# Altium project C27337A_NI_STS_IFX_C55SOI_302149633_V3_04.PrjPcb (part 2 of 2)

## Sheet 43-PSU_SMU_HP.SchDoc
size 594 x 420 mm
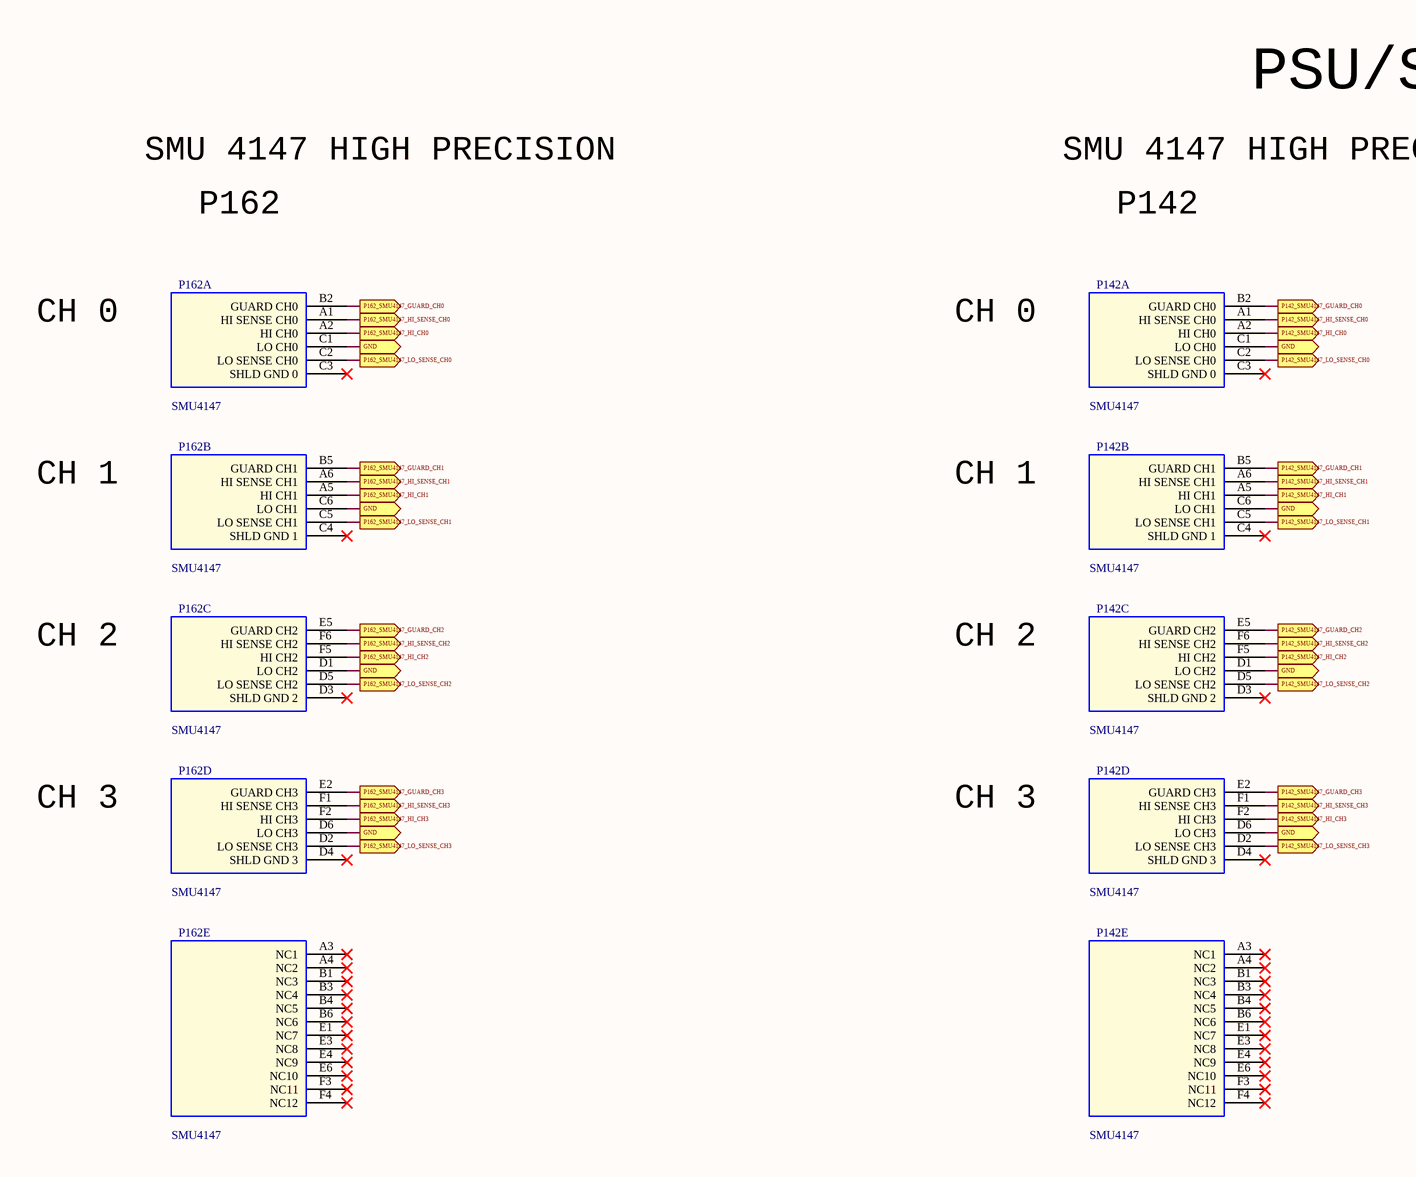
[diagram p23: 43-PSU_SMU_HP.SchDoc, top left]
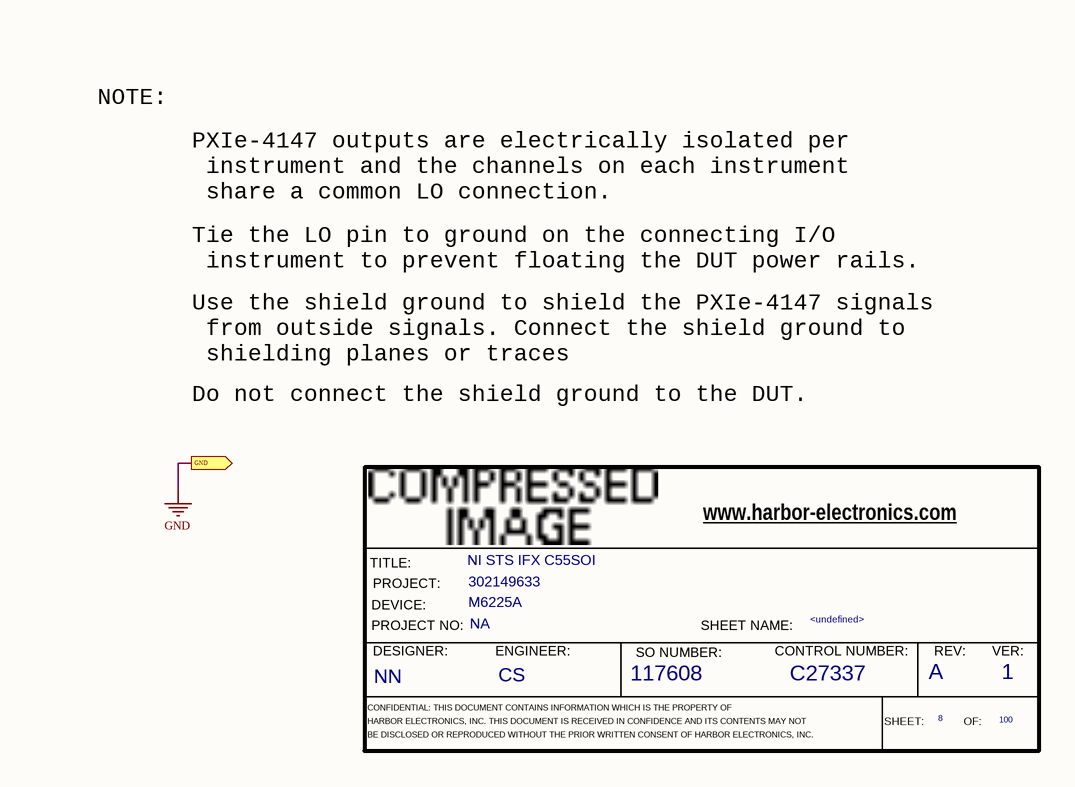
[diagram p24: 43-PSU_SMU_HP.SchDoc, bottom right]

### Parts
(Parts that share a designator on the sheet are numbered #1, #2 ... from top to bottom, then left to right.)
*#9  RevCode: A  Title: NI STS IFX C55SOI  Page Number: 8  Page Count: 100  Engineer: CS  Designer: NN  SO Number: 117608  Control Number: C27337  Version: 1  Page Name: <undefined>  PROJECT: 302149633  DEVICE: M6225A  PROJECT NO.: NA  (hidden comment: HE_DEFAULT)  (graphical)
P142  SMU4147  [285092A-08_36PIN]  (parts A,B,C,D,E of 5)
P162  SMU4147  [285092A-08_36PIN]  (parts A,B,C,D,E of 5)

### Ports
GND (out), P142_SMU4147_GUARD_CH0 (out), P142_SMU4147_GUARD_CH1 (out), P142_SMU4147_GUARD_CH2 (out), P142_SMU4147_GUARD_CH3 (out), P142_SMU4147_HI_CH0 (out), P142_SMU4147_HI_CH1 (out), P142_SMU4147_HI_CH2 (out), P142_SMU4147_HI_CH3 (out), P142_SMU4147_HI_SENSE_CH0 (out), P142_SMU4147_HI_SENSE_CH1 (out), P142_SMU4147_HI_SENSE_CH2 (out), P142_SMU4147_HI_SENSE_CH3 (out), P142_SMU4147_LO_SENSE_CH0 (out), P142_SMU4147_LO_SENSE_CH1 (out), P142_SMU4147_LO_SENSE_CH2 (out), P142_SMU4147_LO_SENSE_CH3 (out), P162_SMU4147_GUARD_CH0 (out), P162_SMU4147_GUARD_CH1 (out), P162_SMU4147_GUARD_CH2 (out), P162_SMU4147_GUARD_CH3 (out), P162_SMU4147_HI_CH0 (out), P162_SMU4147_HI_CH1 (out), P162_SMU4147_HI_CH2 (out), P162_SMU4147_HI_CH3 (out), P162_SMU4147_HI_SENSE_CH0 (out), P162_SMU4147_HI_SENSE_CH1 (out), P162_SMU4147_HI_SENSE_CH2 (out), P162_SMU4147_HI_SENSE_CH3 (out), P162_SMU4147_LO_SENSE_CH0 (out), P162_SMU4147_LO_SENSE_CH1 (out), P162_SMU4147_LO_SENSE_CH2 (out), P162_SMU4147_LO_SENSE_CH3 (out)

### Nets
GND: P142.C1(LO_CH0) P142.C6(LO_CH1) P142.D1(LO_CH2) P142.D6(LO_CH3) P162.C1(LO_CH0) P162.C6(LO_CH1) P162.D1(LO_CH2) P162.D6(LO_CH3) ; port GND
NetP142_A1: P142.A1(HI_SENSE_CH0) ; port P142_SMU4147_HI_SENSE_CH0
NetP142_A2: P142.A2(HI_CH0) ; port P142_SMU4147_HI_CH0
NetP142_A5: P142.A5(HI_CH1) ; port P142_SMU4147_HI_CH1
NetP142_A6: P142.A6(HI_SENSE_CH1) ; port P142_SMU4147_HI_SENSE_CH1
NetP142_B2: P142.B2(GUARD_CH0) ; port P142_SMU4147_GUARD_CH0
NetP142_B5: P142.B5(GUARD_CH1) ; port P142_SMU4147_GUARD_CH1
NetP142_C2: P142.C2(LO_SENSE_CH0) ; port P142_SMU4147_LO_SENSE_CH0
NetP142_C5: P142.C5(LO_SENSE_CH1) ; port P142_SMU4147_LO_SENSE_CH1
NetP142_D2: P142.D2(LO_SENSE_CH3) ; port P142_SMU4147_LO_SENSE_CH3
NetP142_D5: P142.D5(LO_SENSE_CH2) ; port P142_SMU4147_LO_SENSE_CH2
NetP142_E2: P142.E2(GUARD_CH3) ; port P142_SMU4147_GUARD_CH3
NetP142_E5: P142.E5(GUARD_CH2) ; port P142_SMU4147_GUARD_CH2
NetP142_F1: P142.F1(HI_SENSE_CH3) ; port P142_SMU4147_HI_SENSE_CH3
NetP142_F2: P142.F2(HI_CH3) ; port P142_SMU4147_HI_CH3
NetP142_F5: P142.F5(HI_CH2) ; port P142_SMU4147_HI_CH2
NetP142_F6: P142.F6(HI_SENSE_CH2) ; port P142_SMU4147_HI_SENSE_CH2
NetP162_A1: P162.A1(HI_SENSE_CH0) ; port P162_SMU4147_HI_SENSE_CH0
NetP162_A2: P162.A2(HI_CH0) ; port P162_SMU4147_HI_CH0
NetP162_A5: P162.A5(HI_CH1) ; port P162_SMU4147_HI_CH1
NetP162_A6: P162.A6(HI_SENSE_CH1) ; port P162_SMU4147_HI_SENSE_CH1
NetP162_B2: P162.B2(GUARD_CH0) ; port P162_SMU4147_GUARD_CH0
NetP162_B5: P162.B5(GUARD_CH1) ; port P162_SMU4147_GUARD_CH1
NetP162_C2: P162.C2(LO_SENSE_CH0) ; port P162_SMU4147_LO_SENSE_CH0
NetP162_C5: P162.C5(LO_SENSE_CH1) ; port P162_SMU4147_LO_SENSE_CH1
NetP162_D2: P162.D2(LO_SENSE_CH3) ; port P162_SMU4147_LO_SENSE_CH3
NetP162_D5: P162.D5(LO_SENSE_CH2) ; port P162_SMU4147_LO_SENSE_CH2
NetP162_E2: P162.E2(GUARD_CH3) ; port P162_SMU4147_GUARD_CH3
NetP162_E5: P162.E5(GUARD_CH2) ; port P162_SMU4147_GUARD_CH2
NetP162_F1: P162.F1(HI_SENSE_CH3) ; port P162_SMU4147_HI_SENSE_CH3
NetP162_F2: P162.F2(HI_CH3) ; port P162_SMU4147_HI_CH3
NetP162_F5: P162.F5(HI_CH2) ; port P162_SMU4147_HI_CH2
NetP162_F6: P162.F6(HI_SENSE_CH2) ; port P162_SMU4147_HI_SENSE_CH2

Not connected (* = marked no-connect by the designer): P142 A3(NC1)* A4(NC2)* B1(NC3)* B3(NC4)* B4(NC5)* B6(NC6)* C3(SHLD_GND_0)* C4(SHLD_GND_1)* D3(SHLD_GND_2)* D4(SHLD_GND_3)* E1(NC7)* E3(NC8)* E4(NC9)* E6(NC10)* F3(NC11)* F4(NC12)*; P162 A3(NC1)* A4(NC2)* B1(NC3)* B3(NC4)* B4(NC5)* B6(NC6)* C3(SHLD_GND_0)* C4(SHLD_GND_1)* D3(SHLD_GND_2)* D4(SHLD_GND_3)* E1(NC7)* E3(NC8)* E4(NC9)* E6(NC10)* F3(NC11)* F4(NC12)*

### Notes on the sheet
- PSU/SMU
- SMU 4147 HIGH PRECISION
- P162
- P142
- CH 0
- CH 1
- CH 2
- CH 3
- NOTE:
- PXIe-4147 outputs are electrically isolated per
  instrument and the channels on each instrument
  share a common LO connection.
- Tie the LO pin to ground on the connecting I/O
  instrument to prevent floating the DUT power rails.
- Use the shield ground to shield the PXIe-4147 signals
  from outside signals. Connect the shield ground to
  shielding planes or traces
- Do not connect the shield ground to the DUT.
- (in symbol HE_DEFAULT) www.harbor-electronics.com; TITLE:; PROJECT:; DEVICE:; PROJECT NO:; SHEET NAME:; DESIGNER:; ENGINEER:; SO NUMBER:; CONTROL NUMBER:; REV:; VER:; CONFIDENTIAL: THIS DOCUMENT CONTAINS INFORMATION WHICH IS THE PROPERTY OF; HARBOR ELECTRONICS, INC. THIS DOCUMENT IS RECEIVED IN CONFIDENCE AND ITS CONTENTS MAY NOT; SHEET:; OF:; BE DISCLOSED OR REPRODUCED WITHOUT THE PRIOR WRITTEN CONSENT OF HARBOR ELECTRONICS, INC.

### Library data of the parts
*#9 = HE_DEFAULT: Page Size: X; OrgAddr4: Fax: +1 602-431-9633; OrgAddr1: 4050 E. Cotton Center Blvd., Suite 33; OrgAddr2: Phoenix, Arizona 85040 U.S.A.; OrgAddr3: Phone: +1 602-438-1112; Doc: <Title Name>; OrgName: HARBOR
P142 P162 = SMU4147: SPLIT_INST: TRUE; SWAP_INFO: (S1+S2+S3+S4+S5); PCB Footprint: 285092A-08_36PIN

## Sheet 45-RELAY_MUX_SWITCH.SchDoc
size 594 x 420 mm
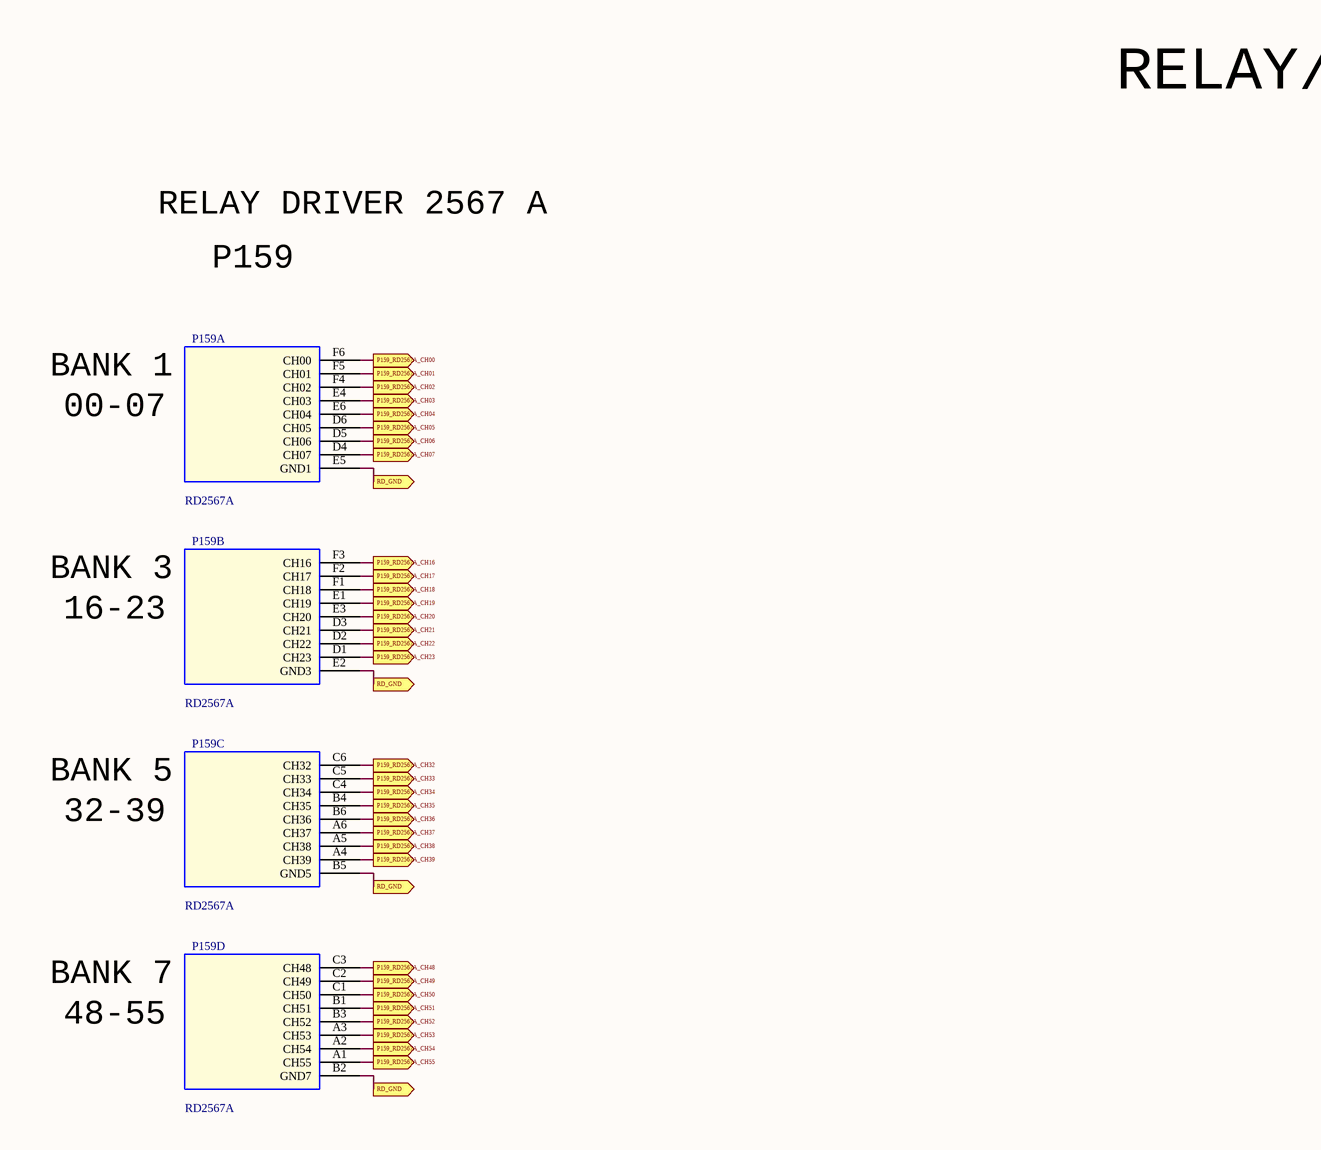
[diagram p25: 45-RELAY_MUX_SWITCH.SchDoc, top left]
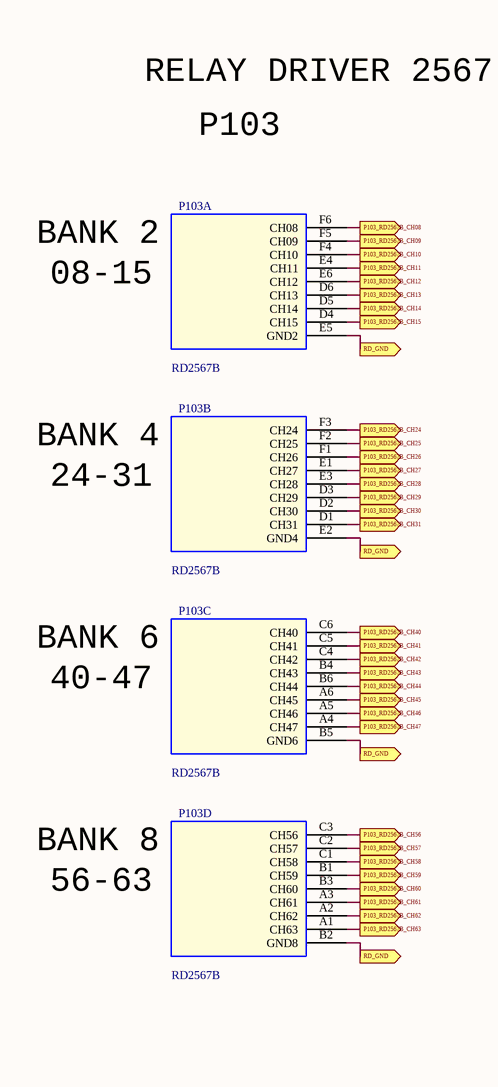
[diagram p26: 45-RELAY_MUX_SWITCH.SchDoc, bottom left]
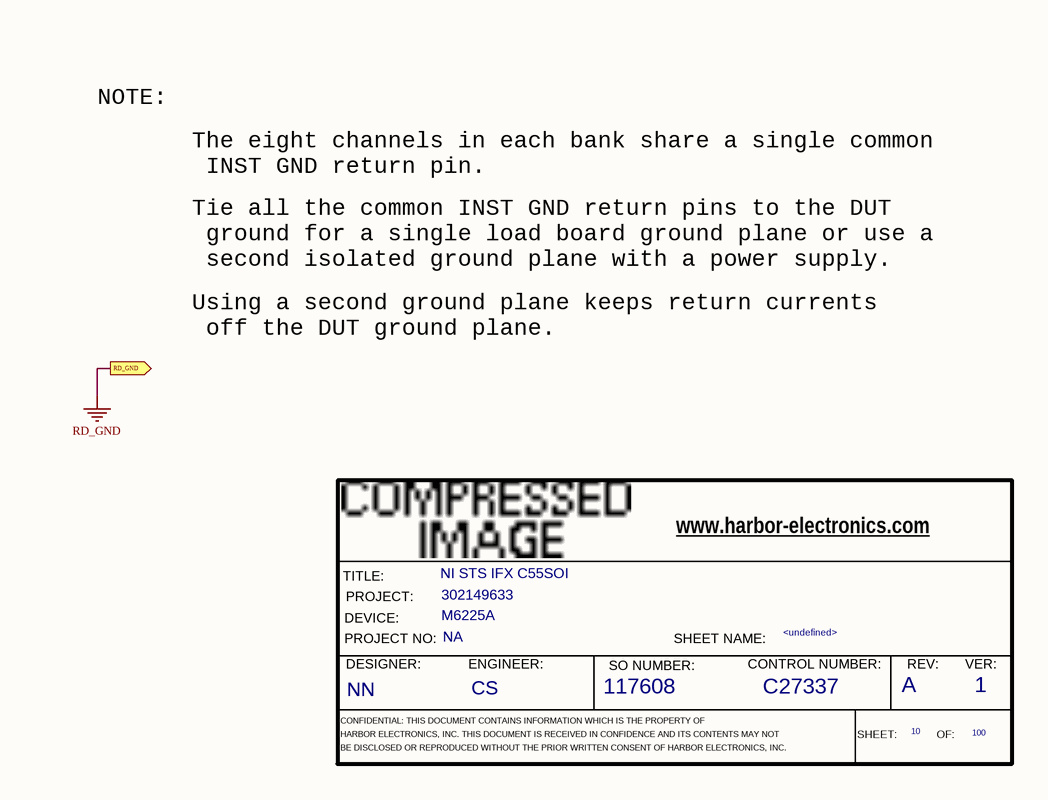
[diagram p27: 45-RELAY_MUX_SWITCH.SchDoc, bottom right]

### Parts
(Parts that share a designator on the sheet are numbered #1, #2 ... from top to bottom, then left to right.)
*#10  RevCode: A  Title: NI STS IFX C55SOI  Page Number: 10  Page Count: 100  Engineer: CS  Designer: NN  SO Number: 117608  Control Number: C27337  Version: 1  Page Name: <undefined>  PROJECT: 302149633  DEVICE: M6225A  PROJECT NO.: NA  (hidden comment: HE_DEFAULT)  (graphical)
P103  RD2567B  [285092A-08_36PIN]  (parts A,B,C,D of 4)
P159  RD2567A  [285092A-08_36PIN]  (parts A,B,C,D of 4)

### Ports
P103_RD2567B_CH08 (out), P103_RD2567B_CH09 (out), P103_RD2567B_CH10 (out), P103_RD2567B_CH11 (out), P103_RD2567B_CH12 (out), P103_RD2567B_CH13 (out), P103_RD2567B_CH14 (out), P103_RD2567B_CH15 (out), P103_RD2567B_CH24 (out), P103_RD2567B_CH25 (out), P103_RD2567B_CH26 (out), P103_RD2567B_CH27 (out), P103_RD2567B_CH28 (out), P103_RD2567B_CH29 (out), P103_RD2567B_CH30 (out), P103_RD2567B_CH31 (out), P103_RD2567B_CH40 (out), P103_RD2567B_CH41 (out), P103_RD2567B_CH42 (out), P103_RD2567B_CH43 (out), P103_RD2567B_CH44 (out), P103_RD2567B_CH45 (out), P103_RD2567B_CH46 (out), P103_RD2567B_CH47 (out), P103_RD2567B_CH56 (out), P103_RD2567B_CH57 (out), P103_RD2567B_CH58 (out), P103_RD2567B_CH59 (out), P103_RD2567B_CH60 (out), P103_RD2567B_CH61 (out), P103_RD2567B_CH62 (out), P103_RD2567B_CH63 (out), P159_RD2567A_CH00 (out), P159_RD2567A_CH01 (out), P159_RD2567A_CH02 (out), P159_RD2567A_CH03 (out), P159_RD2567A_CH04 (out), P159_RD2567A_CH05 (out), P159_RD2567A_CH06 (out), P159_RD2567A_CH07 (out), P159_RD2567A_CH16 (out), P159_RD2567A_CH17 (out), P159_RD2567A_CH18 (out), P159_RD2567A_CH19 (out), P159_RD2567A_CH20 (out), P159_RD2567A_CH21 (out), P159_RD2567A_CH22 (out), P159_RD2567A_CH23 (out), P159_RD2567A_CH32 (out), P159_RD2567A_CH33 (out), P159_RD2567A_CH34 (out), P159_RD2567A_CH35 (out), P159_RD2567A_CH36 (out), P159_RD2567A_CH37 (out), P159_RD2567A_CH38 (out), P159_RD2567A_CH39 (out), P159_RD2567A_CH48 (out), P159_RD2567A_CH49 (out), P159_RD2567A_CH50 (out), P159_RD2567A_CH51 (out), P159_RD2567A_CH52 (out), P159_RD2567A_CH53 (out), P159_RD2567A_CH54 (out), P159_RD2567A_CH55 (out), RD_GND (out)

### Nets
RD_GND: P103.B2(GND8) P103.B5(GND6) P103.E2(GND4) P103.E5(GND2) P159.B2(GND7) P159.B5(GND5) P159.E2(GND3) P159.E5(GND1) ; port RD_GND
NetP103_A1: P103.A1(CH63) ; port P103_RD2567B_CH63
NetP103_A2: P103.A2(CH62) ; port P103_RD2567B_CH62
NetP103_A3: P103.A3(CH61) ; port P103_RD2567B_CH61
NetP103_A4: P103.A4(CH47) ; port P103_RD2567B_CH47
NetP103_A5: P103.A5(CH46) ; port P103_RD2567B_CH46
NetP103_A6: P103.A6(CH45) ; port P103_RD2567B_CH45
NetP103_B1: P103.B1(CH59) ; port P103_RD2567B_CH59
NetP103_B3: P103.B3(CH60) ; port P103_RD2567B_CH60
NetP103_B4: P103.B4(CH43) ; port P103_RD2567B_CH43
NetP103_B6: P103.B6(CH44) ; port P103_RD2567B_CH44
NetP103_C1: P103.C1(CH58) ; port P103_RD2567B_CH58
NetP103_C2: P103.C2(CH57) ; port P103_RD2567B_CH57
NetP103_C3: P103.C3(CH56) ; port P103_RD2567B_CH56
NetP103_C4: P103.C4(CH42) ; port P103_RD2567B_CH42
NetP103_C5: P103.C5(CH41) ; port P103_RD2567B_CH41
NetP103_C6: P103.C6(CH40) ; port P103_RD2567B_CH40
NetP103_D1: P103.D1(CH31) ; port P103_RD2567B_CH31
NetP103_D2: P103.D2(CH30) ; port P103_RD2567B_CH30
NetP103_D3: P103.D3(CH29) ; port P103_RD2567B_CH29
NetP103_D4: P103.D4(CH15) ; port P103_RD2567B_CH15
NetP103_D5: P103.D5(CH14) ; port P103_RD2567B_CH14
NetP103_D6: P103.D6(CH13) ; port P103_RD2567B_CH13
NetP103_E1: P103.E1(CH27) ; port P103_RD2567B_CH27
NetP103_E3: P103.E3(CH28) ; port P103_RD2567B_CH28
NetP103_E4: P103.E4(CH11) ; port P103_RD2567B_CH11
NetP103_E6: P103.E6(CH12) ; port P103_RD2567B_CH12
NetP103_F1: P103.F1(CH26) ; port P103_RD2567B_CH26
NetP103_F2: P103.F2(CH25) ; port P103_RD2567B_CH25
NetP103_F3: P103.F3(CH24) ; port P103_RD2567B_CH24
NetP103_F4: P103.F4(CH10) ; port P103_RD2567B_CH10
NetP103_F5: P103.F5(CH09) ; port P103_RD2567B_CH09
NetP103_F6: P103.F6(CH08) ; port P103_RD2567B_CH08
NetP159_A1: P159.A1(CH55) ; port P159_RD2567A_CH55
NetP159_A2: P159.A2(CH54) ; port P159_RD2567A_CH54
NetP159_A3: P159.A3(CH53) ; port P159_RD2567A_CH53
NetP159_A4: P159.A4(CH39) ; port P159_RD2567A_CH39
NetP159_A5: P159.A5(CH38) ; port P159_RD2567A_CH38
NetP159_A6: P159.A6(CH37) ; port P159_RD2567A_CH37
NetP159_B1: P159.B1(CH51) ; port P159_RD2567A_CH51
NetP159_B3: P159.B3(CH52) ; port P159_RD2567A_CH52
NetP159_B4: P159.B4(CH35) ; port P159_RD2567A_CH35
NetP159_B6: P159.B6(CH36) ; port P159_RD2567A_CH36
NetP159_C1: P159.C1(CH50) ; port P159_RD2567A_CH50
NetP159_C2: P159.C2(CH49) ; port P159_RD2567A_CH49
NetP159_C3: P159.C3(CH48) ; port P159_RD2567A_CH48
NetP159_C4: P159.C4(CH34) ; port P159_RD2567A_CH34
NetP159_C5: P159.C5(CH33) ; port P159_RD2567A_CH33
NetP159_C6: P159.C6(CH32) ; port P159_RD2567A_CH32
NetP159_D1: P159.D1(CH23) ; port P159_RD2567A_CH23
NetP159_D2: P159.D2(CH22) ; port P159_RD2567A_CH22
NetP159_D3: P159.D3(CH21) ; port P159_RD2567A_CH21
NetP159_D4: P159.D4(CH07) ; port P159_RD2567A_CH07
NetP159_D5: P159.D5(CH06) ; port P159_RD2567A_CH06
NetP159_D6: P159.D6(CH05) ; port P159_RD2567A_CH05
NetP159_E1: P159.E1(CH19) ; port P159_RD2567A_CH19
NetP159_E3: P159.E3(CH20) ; port P159_RD2567A_CH20
NetP159_E4: P159.E4(CH03) ; port P159_RD2567A_CH03
NetP159_E6: P159.E6(CH04) ; port P159_RD2567A_CH04
NetP159_F1: P159.F1(CH18) ; port P159_RD2567A_CH18
NetP159_F2: P159.F2(CH17) ; port P159_RD2567A_CH17
NetP159_F3: P159.F3(CH16) ; port P159_RD2567A_CH16
NetP159_F4: P159.F4(CH02) ; port P159_RD2567A_CH02
NetP159_F5: P159.F5(CH01) ; port P159_RD2567A_CH01
NetP159_F6: P159.F6(CH00) ; port P159_RD2567A_CH00

### Notes on the sheet
- RELAY/MUX/SWITCH
- RELAY DRIVER 2567 A
- P159
- BANK 1
- 00-07
- BANK 3
- 16-23
- BANK 5
- 32-39
- BANK 7
- 48-55
- RELAY DRIVER 2567 B
- P103
- BANK 2
- 08-15
- BANK 4
- NOTE:
- The eight channels in each bank share a single common
  INST GND return pin.
- 24-31
- Tie all the common INST GND return pins to the DUT
  ground for a single load board ground plane or use a
  second isolated ground plane with a power supply.
- BANK 6
- Using a second ground plane keeps return currents
  off the DUT ground plane.
- 40-47
- BANK 8
- 56-63
- (in symbol HE_DEFAULT) www.harbor-electronics.com; TITLE:; PROJECT:; DEVICE:; PROJECT NO:; SHEET NAME:; DESIGNER:; ENGINEER:; SO NUMBER:; CONTROL NUMBER:; REV:; VER:; CONFIDENTIAL: THIS DOCUMENT CONTAINS INFORMATION WHICH IS THE PROPERTY OF; HARBOR ELECTRONICS, INC. THIS DOCUMENT IS RECEIVED IN CONFIDENCE AND ITS CONTENTS MAY NOT; SHEET:; OF:; BE DISCLOSED OR REPRODUCED WITHOUT THE PRIOR WRITTEN CONSENT OF HARBOR ELECTRONICS, INC.

### Library data of the parts
*#10 = HE_DEFAULT: as *#9 on sheet 43-PSU_SMU_HP
P103 = RD2567B: SPLIT_INST: TRUE; SWAP_INFO: (S1+S2+S3+S4); PCB Footprint: 285092A-08_36PIN
P159 = RD2567A: SPLIT_INST: TRUE; SWAP_INFO: (S1+S2+S3+S4); PCB Footprint: 285092A-08_36PIN

## Sheet 47-SOURCES_AWG.SchDoc
size 594 x 420 mm
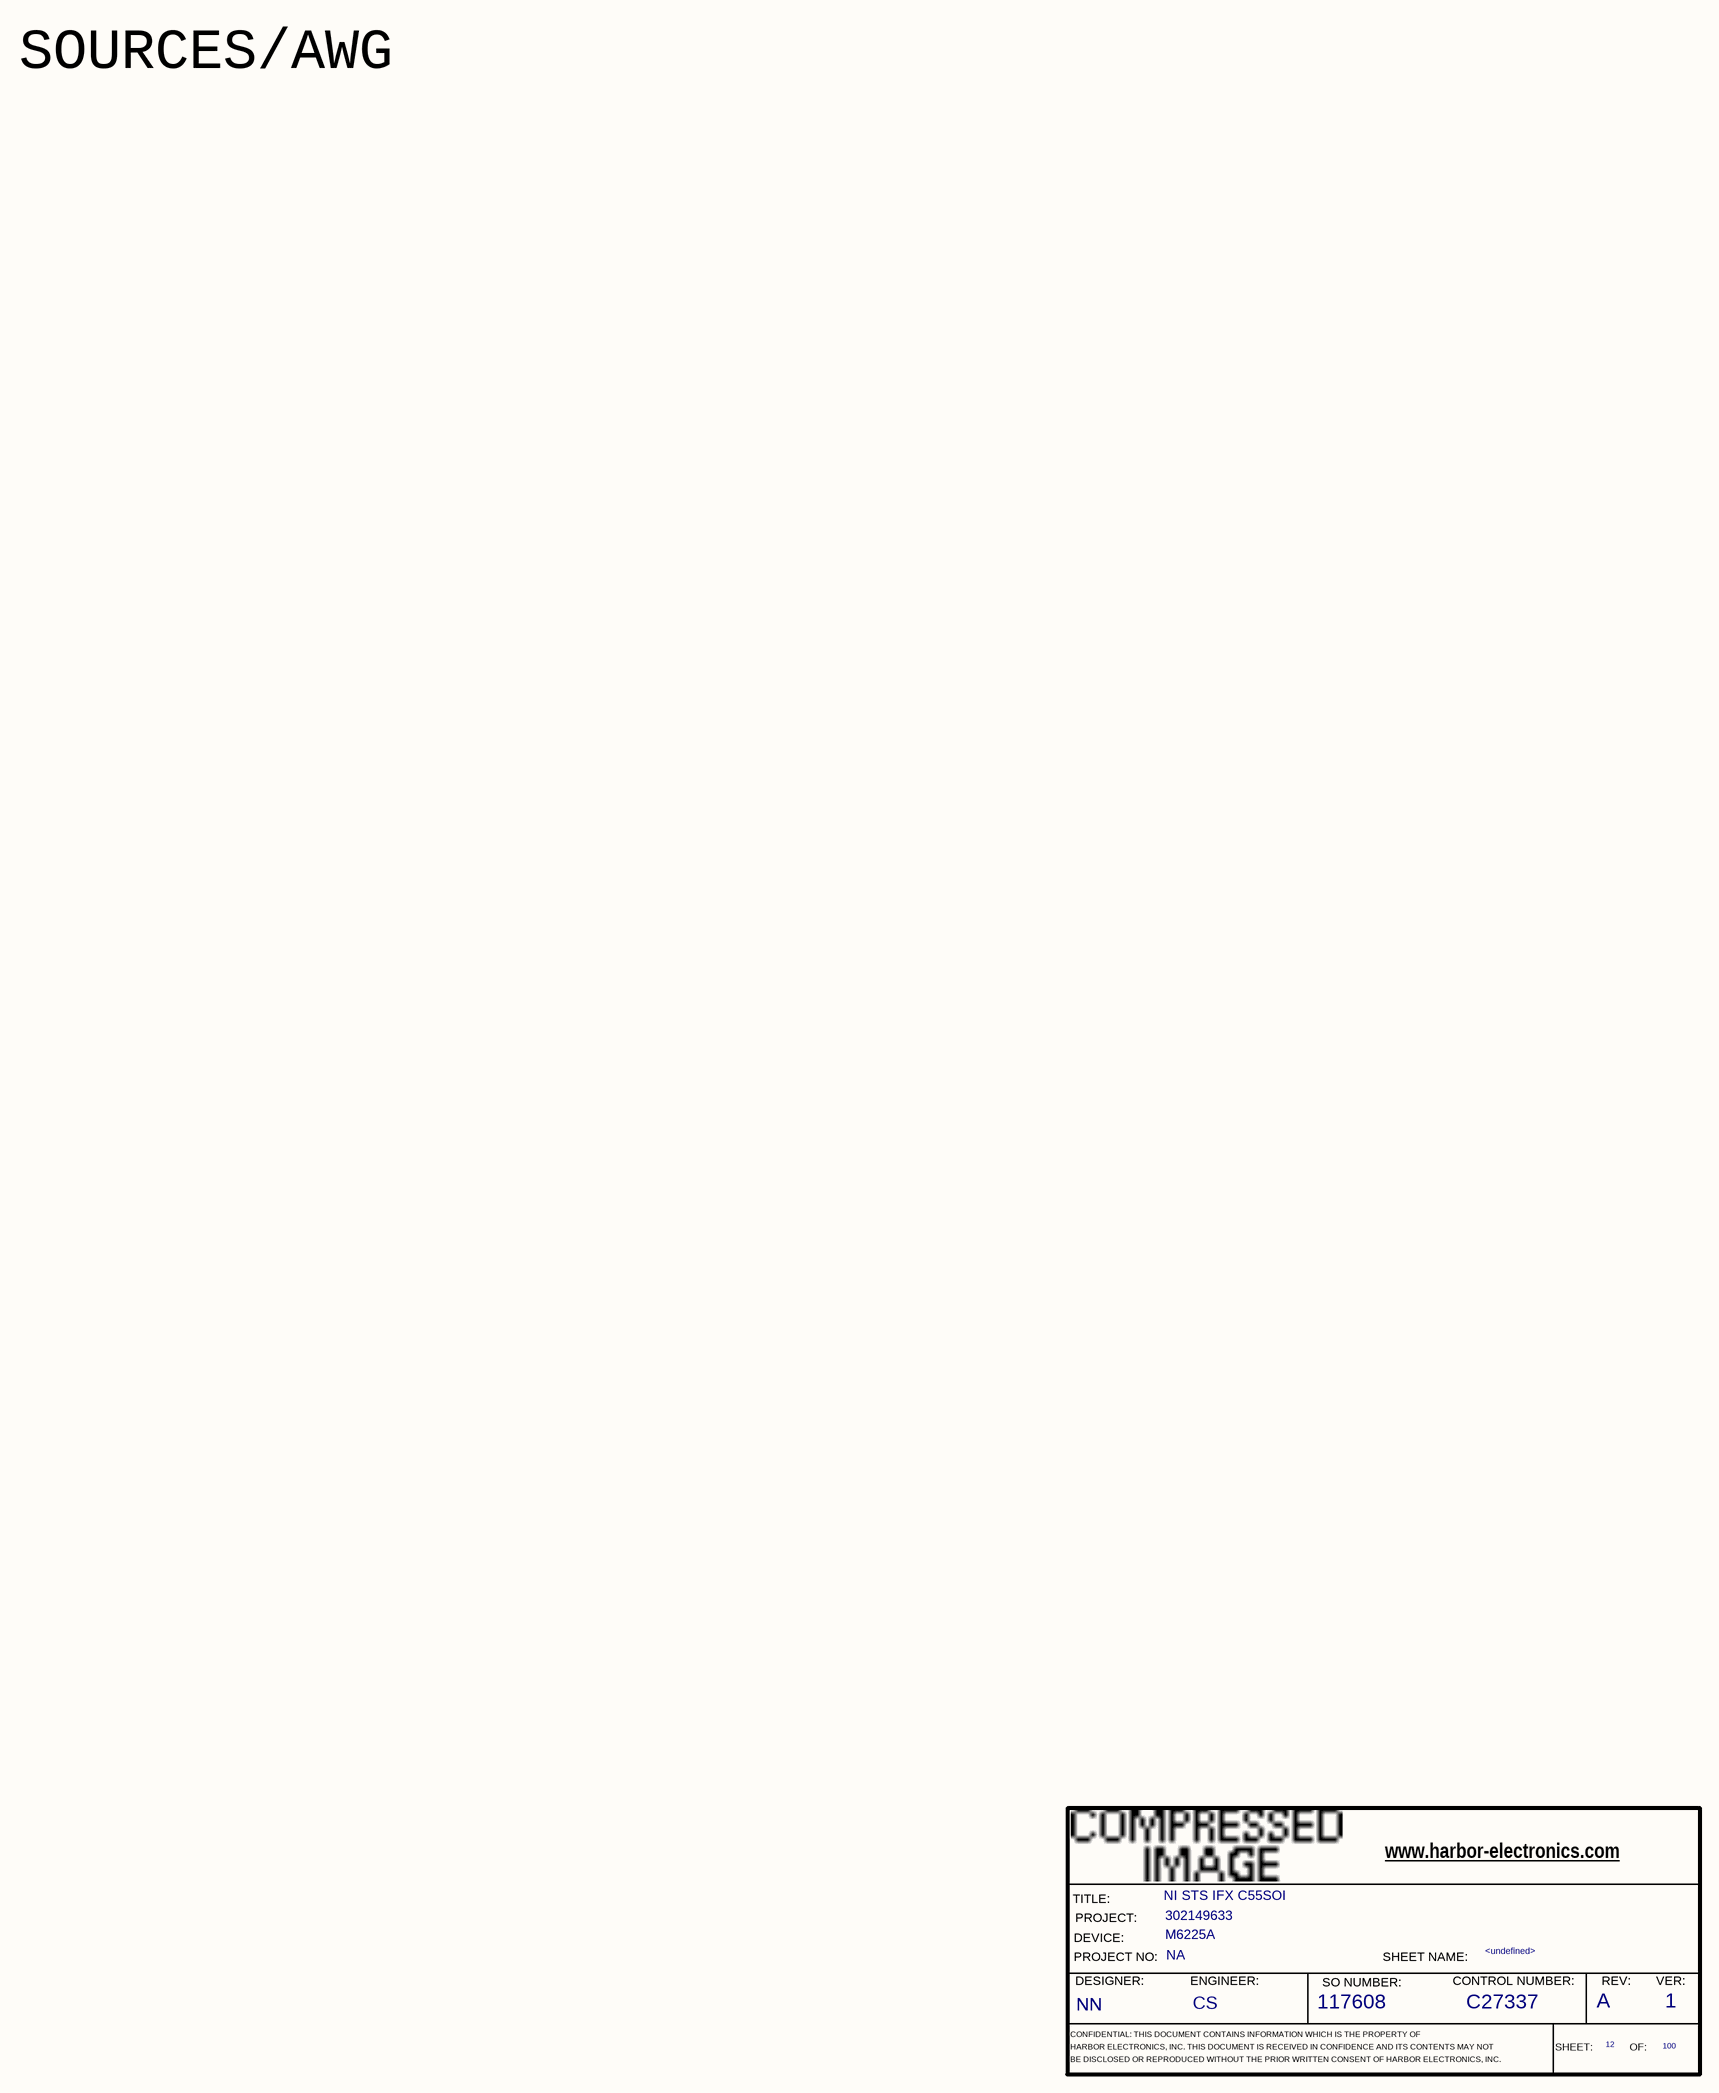
[diagram p28: 47-SOURCES_AWG.SchDoc]

### Parts
(Parts that share a designator on the sheet are numbered #1, #2 ... from top to bottom, then left to right.)
*#11  RevCode: A  Title: NI STS IFX C55SOI  Page Number: 12  Page Count: 100  Engineer: CS  Designer: NN  SO Number: 117608  Control Number: C27337  Version: 1  Page Name: <undefined>  PROJECT: 302149633  DEVICE: M6225A  PROJECT NO.: NA  (hidden comment: HE_DEFAULT)  (graphical)

### Notes on the sheet
- SOURCES/AWG
- (in symbol HE_DEFAULT) www.harbor-electronics.com; TITLE:; PROJECT:; DEVICE:; PROJECT NO:; SHEET NAME:; DESIGNER:; ENGINEER:; SO NUMBER:; CONTROL NUMBER:; REV:; VER:; CONFIDENTIAL: THIS DOCUMENT CONTAINS INFORMATION WHICH IS THE PROPERTY OF; HARBOR ELECTRONICS, INC. THIS DOCUMENT IS RECEIVED IN CONFIDENCE AND ITS CONTENTS MAY NOT; SHEET:; OF:; BE DISCLOSED OR REPRODUCED WITHOUT THE PRIOR WRITTEN CONSENT OF HARBOR ELECTRONICS, INC.

### Library data of the parts
*#11 = HE_DEFAULT: as *#9 on sheet 43-PSU_SMU_HP

## Sheet 50-BLANK 101-120.SchDoc
size 594 x 420 mm
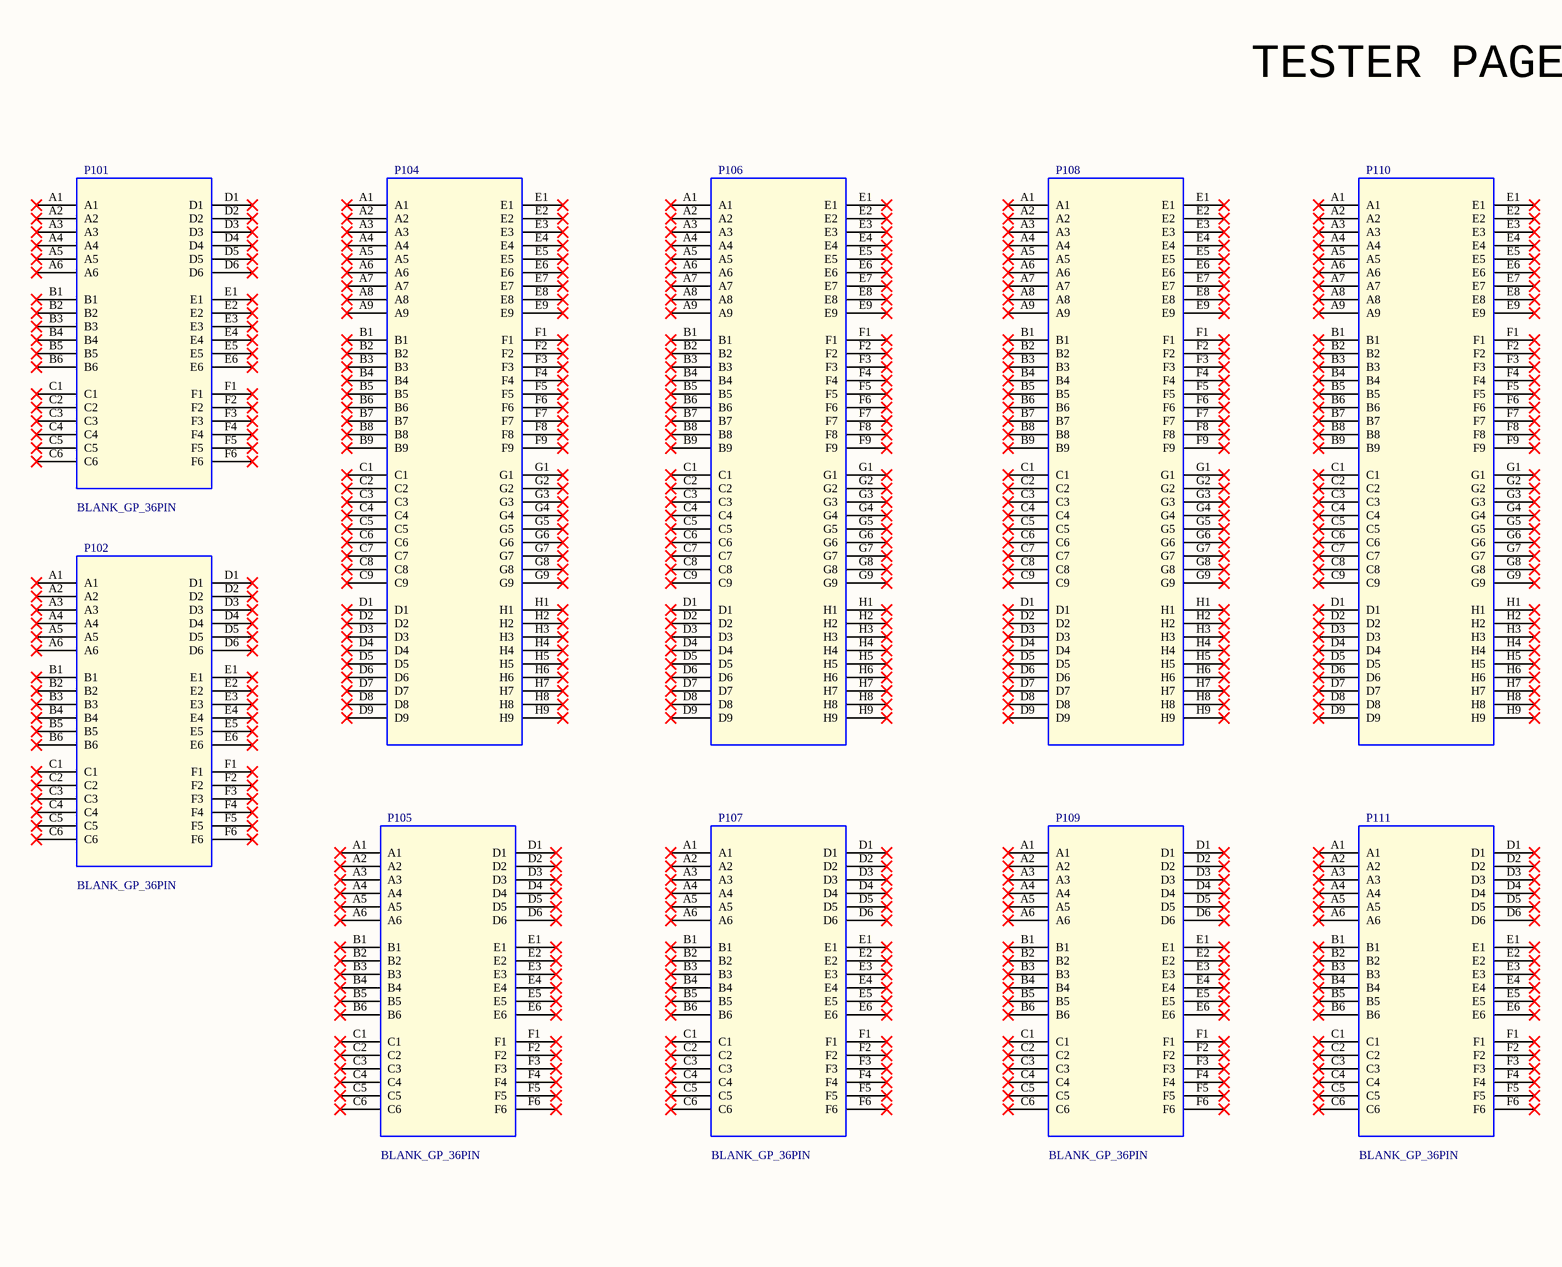
[diagram p29: 50-BLANK 101-120.SchDoc, left]
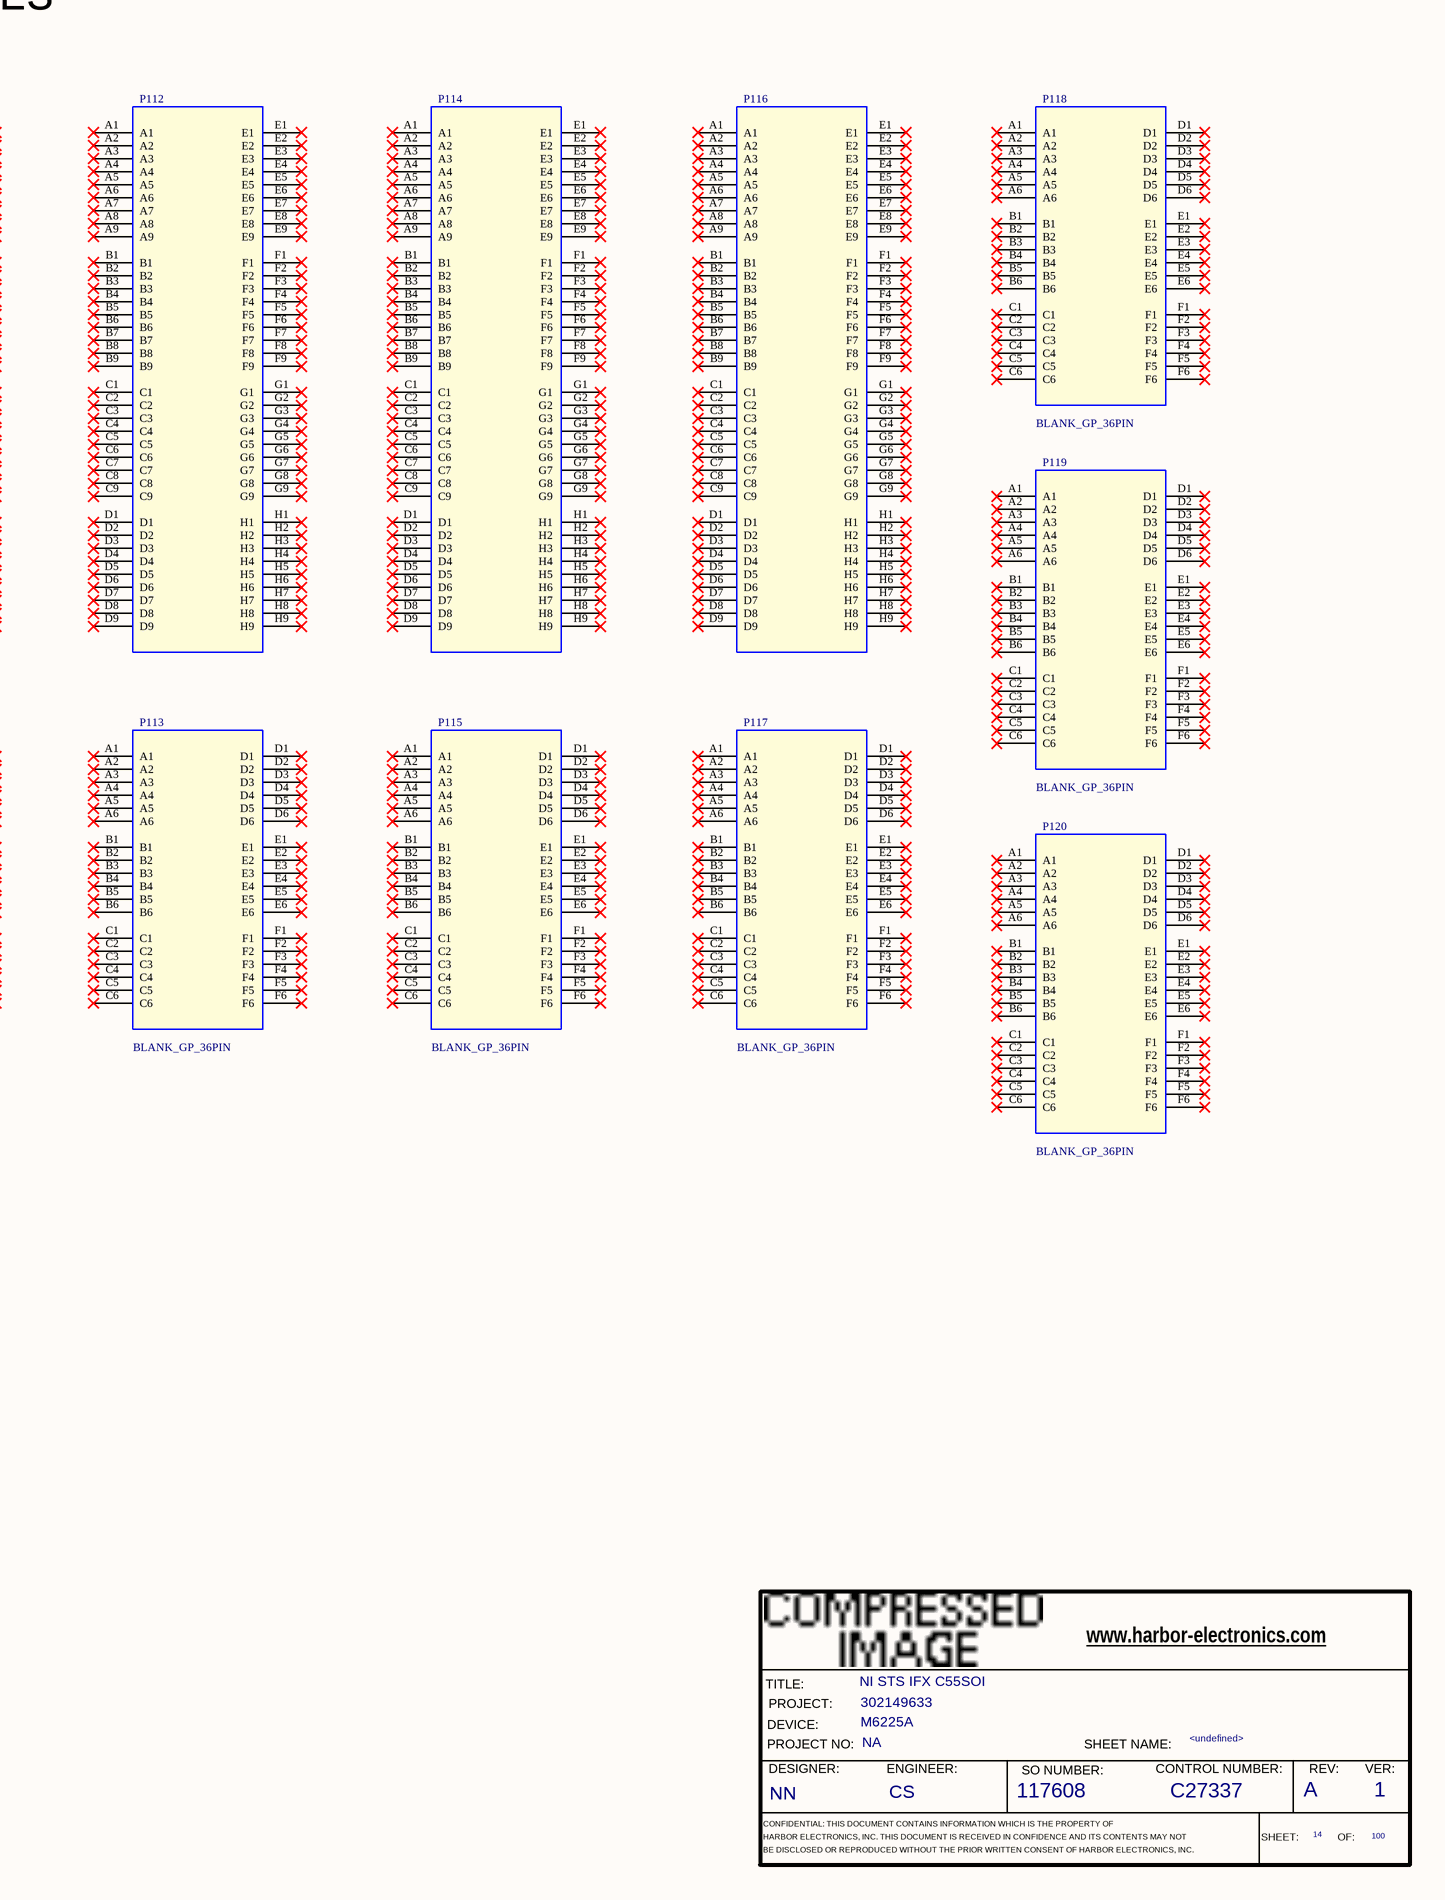
[diagram p30: 50-BLANK 101-120.SchDoc, right]

### Parts
(Parts that share a designator on the sheet are numbered #1, #2 ... from top to bottom, then left to right.)
*#12  RevCode: A  Title: NI STS IFX C55SOI  Page Number: 14  Page Count: 100  Engineer: CS  Designer: NN  SO Number: 117608  Control Number: C27337  Version: 1  Page Name: <undefined>  PROJECT: 302149633  DEVICE: M6225A  PROJECT NO.: NA  (hidden comment: HE_DEFAULT)  (graphical)
P101  BLANK_GP_36PIN  [285092A-08_36PIN_NOVIA]
P102  BLANK_GP_36PIN  [285092A-08_36PIN_NOVIA]
P104  (no value)  [285092A-08_72PIN_NOVIA]
P105  BLANK_GP_36PIN  [285092A-08_36PIN_NOVIA]
P106  (no value)  [285092A-08_72PIN_NOVIA]
P107  BLANK_GP_36PIN  [285092A-08_36PIN_NOVIA]
P108  (no value)  [285092A-08_72PIN_NOVIA]
P109  BLANK_GP_36PIN  [285092A-08_36PIN_NOVIA]
P110  (no value)  [285092A-08_72PIN_NOVIA]
P111  BLANK_GP_36PIN  [285092A-08_36PIN_NOVIA]
P112  (no value)  [285092A-08_72PIN_NOVIA]
P113  BLANK_GP_36PIN  [285092A-08_36PIN_NOVIA]
P114  (no value)  [285092A-08_72PIN_NOVIA]
P115  BLANK_GP_36PIN  [285092A-08_36PIN_NOVIA]
P116  (no value)  [285092A-08_72PIN_NOVIA]
P117  BLANK_GP_36PIN  [285092A-08_36PIN_NOVIA]
P118  BLANK_GP_36PIN  [285092A-08_36PIN_NOVIA]
P119  BLANK_GP_36PIN  [285092A-08_36PIN_NOVIA]
P120  BLANK_GP_36PIN  [285092A-08_36PIN_NOVIA]

### Nets

Not connected (* = marked no-connect by the designer): P101 A1* A2* A3* A4* A5* A6* B1* B2* B3* B4* B5* B6* C1* C2* C3* C4* C5* C6* D1* D2* D3* D4* D5* D6* E1* E2* E3* E4* E5* E6* F1* F2* F3* F4* F5* F6*; P102 A1* A2* A3* A4* A5* A6* B1* B2* B3* B4* B5* B6* C1* C2* C3* C4* C5* C6* D1* D2* D3* D4* D5* D6* E1* E2* E3* E4* E5* E6* F1* F2* F3* F4* F5* F6*; P104 A1* A2* A3* A4* A5* A6* A7* A8* A9* B1* B2* B3* B4* B5* B6* B7* B8* B9* C1* C2* C3* C4* C5* C6* C7* C8* C9* D1* D2* D3* D4* D5* D6* D7* D8* D9* E1* E2* E3* E4* E5* E6* E7* E8* E9* F1* F2* F3* F4* F5* F6* F7* F8* F9* G1* G2* G3* G4* G5* G6* G7* G8* G9* H1* H2* H3* H4* H5* H6* H7* H8* H9*; P105 A1* A2* A3* A4* A5* A6* B1* B2* B3* B4* B5* B6* C1* C2* C3* C4* C5* C6* D1* D2* D3* D4* D5* D6* E1* E2* E3* E4* E5* E6* F1* F2* F3* F4* F5* F6*; P106 A1* A2* A3* A4* A5* A6* A7* A8* A9* B1* B2* B3* B4* B5* B6* B7* B8* B9* C1* C2* C3* C4* C5* C6* C7* C8* C9* D1* D2* D3* D4* D5* D6* D7* D8* D9* E1* E2* E3* E4* E5* E6* E7* E8* E9* F1* F2* F3* F4* F5* F6* F7* F8* F9* G1* G2* G3* G4* G5* G6* G7* G8* G9* H1* H2* H3* H4* H5* H6* H7* H8* H9*; P107 A1* A2* A3* A4* A5* A6* B1* B2* B3* B4* B5* B6* C1* C2* C3* C4* C5* C6* D1* D2* D3* D4* D5* D6* E1* E2* E3* E4* E5* E6* F1* F2* F3* F4* F5* F6*; P108 A1* A2* A3* A4* A5* A6* A7* A8* A9* B1* B2* B3* B4* B5* B6* B7* B8* B9* C1* C2* C3* C4* C5* C6* C7* C8* C9* D1* D2* D3* D4* D5* D6* D7* D8* D9* E1* E2* E3* E4* E5* E6* E7* E8* E9* F1* F2* F3* F4* F5* F6* F7* F8* F9* G1* G2* G3* G4* G5* G6* G7* G8* G9* H1* H2* H3* H4* H5* H6* H7* H8* H9*; P109 A1* A2* A3* A4* A5* A6* B1* B2* B3* B4* B5* B6* C1* C2* C3* C4* C5* C6* D1* D2* D3* D4* D5* D6* E1* E2* E3* E4* E5* E6* F1* F2* F3* F4* F5* F6*; P110 A1* A2* A3* A4* A5* A6* A7* A8* A9* B1* B2* B3* B4* B5* B6* B7* B8* B9* C1* C2* C3* C4* C5* C6* C7* C8* C9* D1* D2* D3* D4* D5* D6* D7* D8* D9* E1* E2* E3* E4* E5* E6* E7* E8* E9* F1* F2* F3* F4* F5* F6* F7* F8* F9* G1* G2* G3* G4* G5* G6* G7* G8* G9* H1* H2* H3* H4* H5* H6* H7* H8* H9*; P111 A1* A2* A3* A4* A5* A6* B1* B2* B3* B4* B5* B6* C1* C2* C3* C4* C5* C6* D1* D2* D3* D4* D5* D6* E1* E2* E3* E4* E5* E6* F1* F2* F3* F4* F5* F6*; P112 A1* A2* A3* A4* A5* A6* A7* A8* A9* B1* B2* B3* B4* B5* B6* B7* B8* B9* C1* C2* C3* C4* C5* C6* C7* C8* C9* D1* D2* D3* D4* D5* D6* D7* D8* D9* E1* E2* E3* E4* E5* E6* E7* E8* E9* F1* F2* F3* F4* F5* F6* F7* F8* F9* G1* G2* G3* G4* G5* G6* G7* G8* G9* H1* H2* H3* H4* H5* H6* H7* H8* H9*; P113 A1* A2* A3* A4* A5* A6* B1* B2* B3* B4* B5* B6* C1* C2* C3* C4* C5* C6* D1* D2* D3* D4* D5* D6* E1* E2* E3* E4* E5* E6* F1* F2* F3* F4* F5* F6*; P114 A1* A2* A3* A4* A5* A6* A7* A8* A9* B1* B2* B3* B4* B5* B6* B7* B8* B9* C1* C2* C3* C4* C5* C6* C7* C8* C9* D1* D2* D3* D4* D5* D6* D7* D8* D9* E1* E2* E3* E4* E5* E6* E7* E8* E9* F1* F2* F3* F4* F5* F6* F7* F8* F9* G1* G2* G3* G4* G5* G6* G7* G8* G9* H1* H2* H3* H4* H5* H6* H7* H8* H9*; P115 A1* A2* A3* A4* A5* A6* B1* B2* B3* B4* B5* B6* C1* C2* C3* C4* C5* C6* D1* D2* D3* D4* D5* D6* E1* E2* E3* E4* E5* E6* F1* F2* F3* F4* F5* F6*; P116 A1* A2* A3* A4* A5* A6* A7* A8* A9* B1* B2* B3* B4* B5* B6* B7* B8* B9* C1* C2* C3* C4* C5* C6* C7* C8* C9* D1* D2* D3* D4* D5* D6* D7* D8* D9* E1* E2* E3* E4* E5* E6* E7* E8* E9* F1* F2* F3* F4* F5* F6* F7* F8* F9* G1* G2* G3* G4* G5* G6* G7* G8* G9* H1* H2* H3* H4* H5* H6* H7* H8* H9*; P117 A1* A2* A3* A4* A5* A6* B1* B2* B3* B4* B5* B6* C1* C2* C3* C4* C5* C6* D1* D2* D3* D4* D5* D6* E1* E2* E3* E4* E5* E6* F1* F2* F3* F4* F5* F6*; P118 A1* A2* A3* A4* A5* A6* B1* B2* B3* B4* B5* B6* C1* C2* C3* C4* C5* C6* D1* D2* D3* D4* D5* D6* E1* E2* E3* E4* E5* E6* F1* F2* F3* F4* F5* F6*; P119 A1* A2* A3* A4* A5* A6* B1* B2* B3* B4* B5* B6* C1* C2* C3* C4* C5* C6* D1* D2* D3* D4* D5* D6* E1* E2* E3* E4* E5* E6* F1* F2* F3* F4* F5* F6*; P120 A1* A2* A3* A4* A5* A6* B1* B2* B3* B4* B5* B6* C1* C2* C3* C4* C5* C6* D1* D2* D3* D4* D5* D6* E1* E2* E3* E4* E5* E6* F1* F2* F3* F4* F5* F6*

### Notes on the sheet
- TESTER PAGES
- (in symbol HE_DEFAULT) www.harbor-electronics.com; TITLE:; PROJECT:; DEVICE:; PROJECT NO:; SHEET NAME:; DESIGNER:; ENGINEER:; SO NUMBER:; CONTROL NUMBER:; REV:; VER:; CONFIDENTIAL: THIS DOCUMENT CONTAINS INFORMATION WHICH IS THE PROPERTY OF; HARBOR ELECTRONICS, INC. THIS DOCUMENT IS RECEIVED IN CONFIDENCE AND ITS CONTENTS MAY NOT; SHEET:; OF:; BE DISCLOSED OR REPRODUCED WITHOUT THE PRIOR WRITTEN CONSENT OF HARBOR ELECTRONICS, INC.

### Library data of the parts
*#12 = HE_DEFAULT: as *#9 on sheet 43-PSU_SMU_HP
P101 P102 P105 P107 P109 P111 P113 P115 P117-P120 = BLANK_GP_36PIN: ALT_SYMBOLS: 285092A-08_36PIN; PCB Footprint: 285092A-08_36PIN_NOVIA
P104 P106 P108 P110 P112 P114 P116 = BLANK_COAX_72PIN: ALT_SYMBOLS: 285092A-08_72PIN; PCB Footprint: 285092A-08_72PIN_NOVIA

## Sheet 51-BLANK 121-140.SchDoc
size 594 x 420 mm
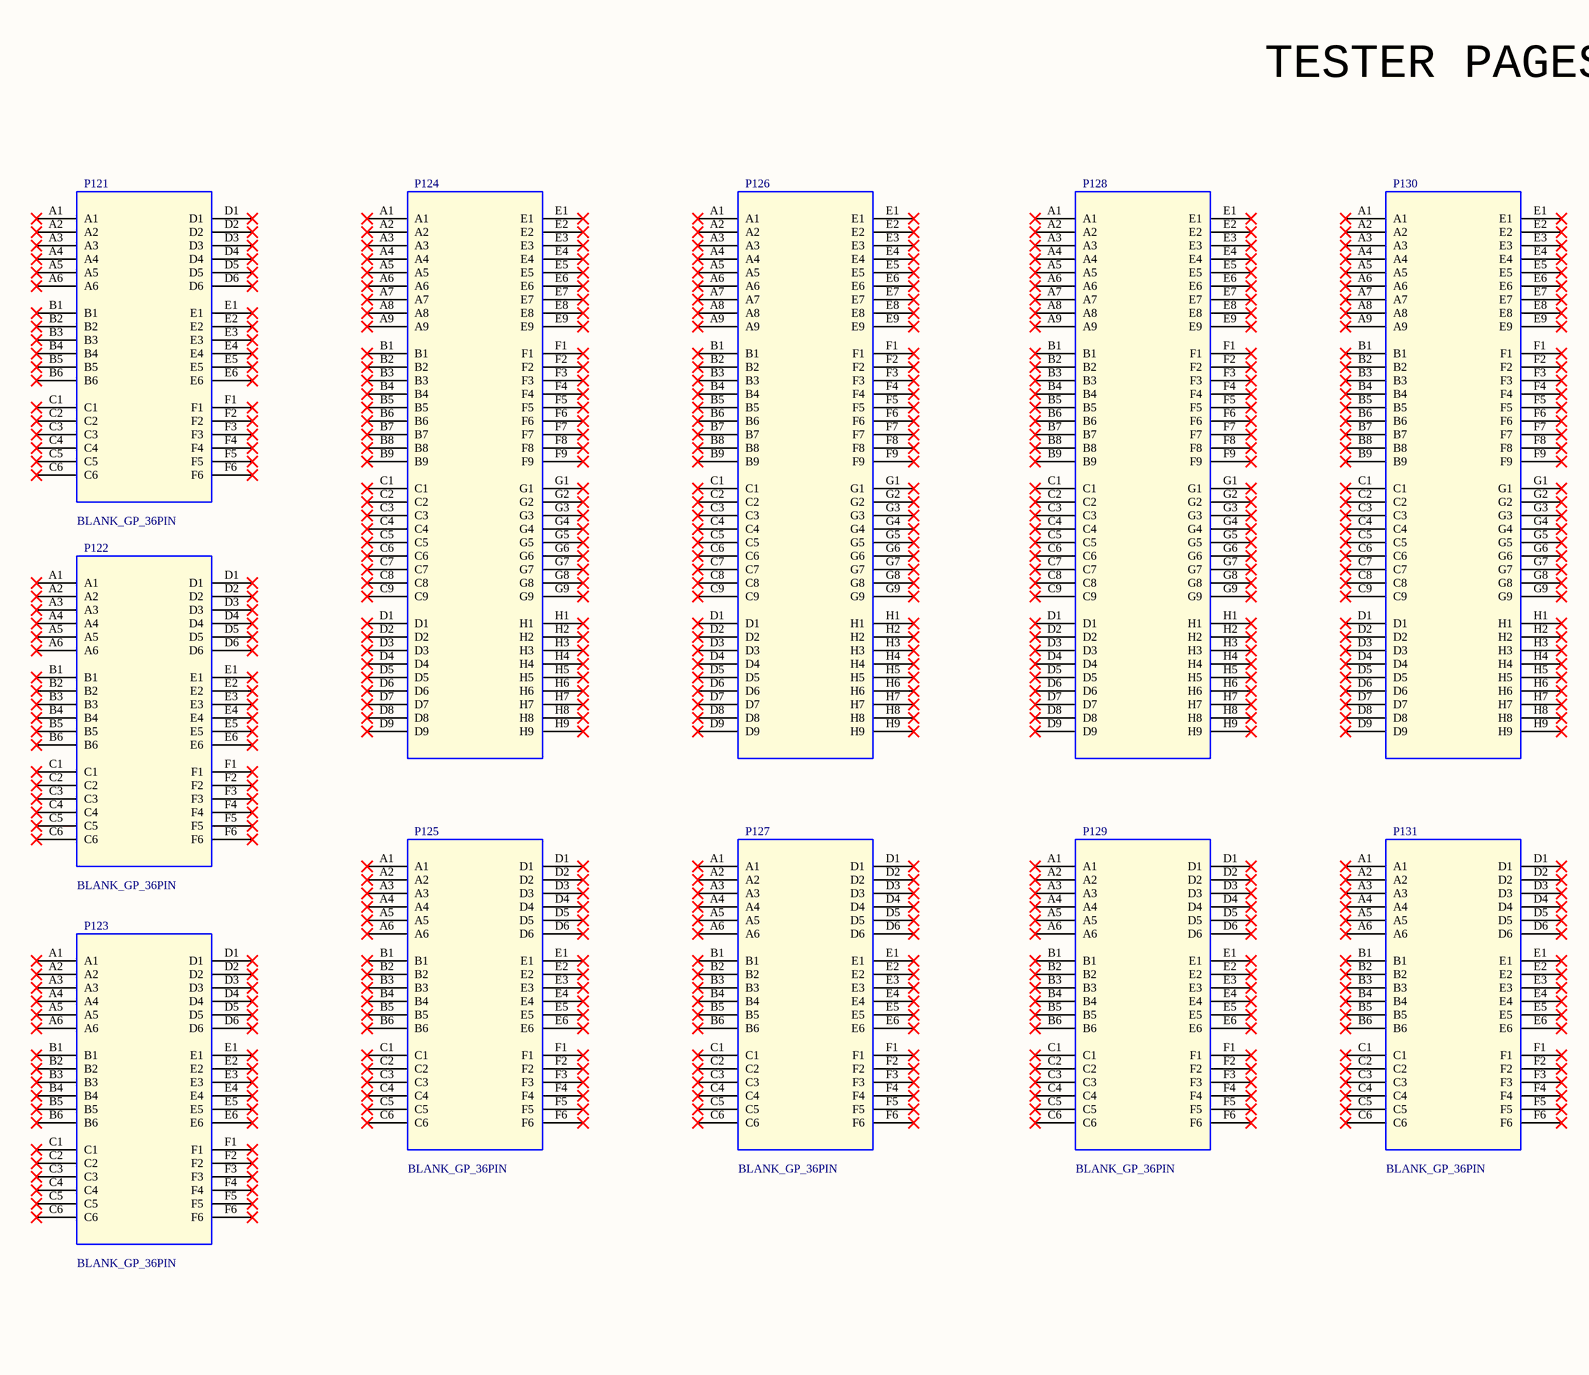
[diagram p31: 51-BLANK 121-140.SchDoc, left]
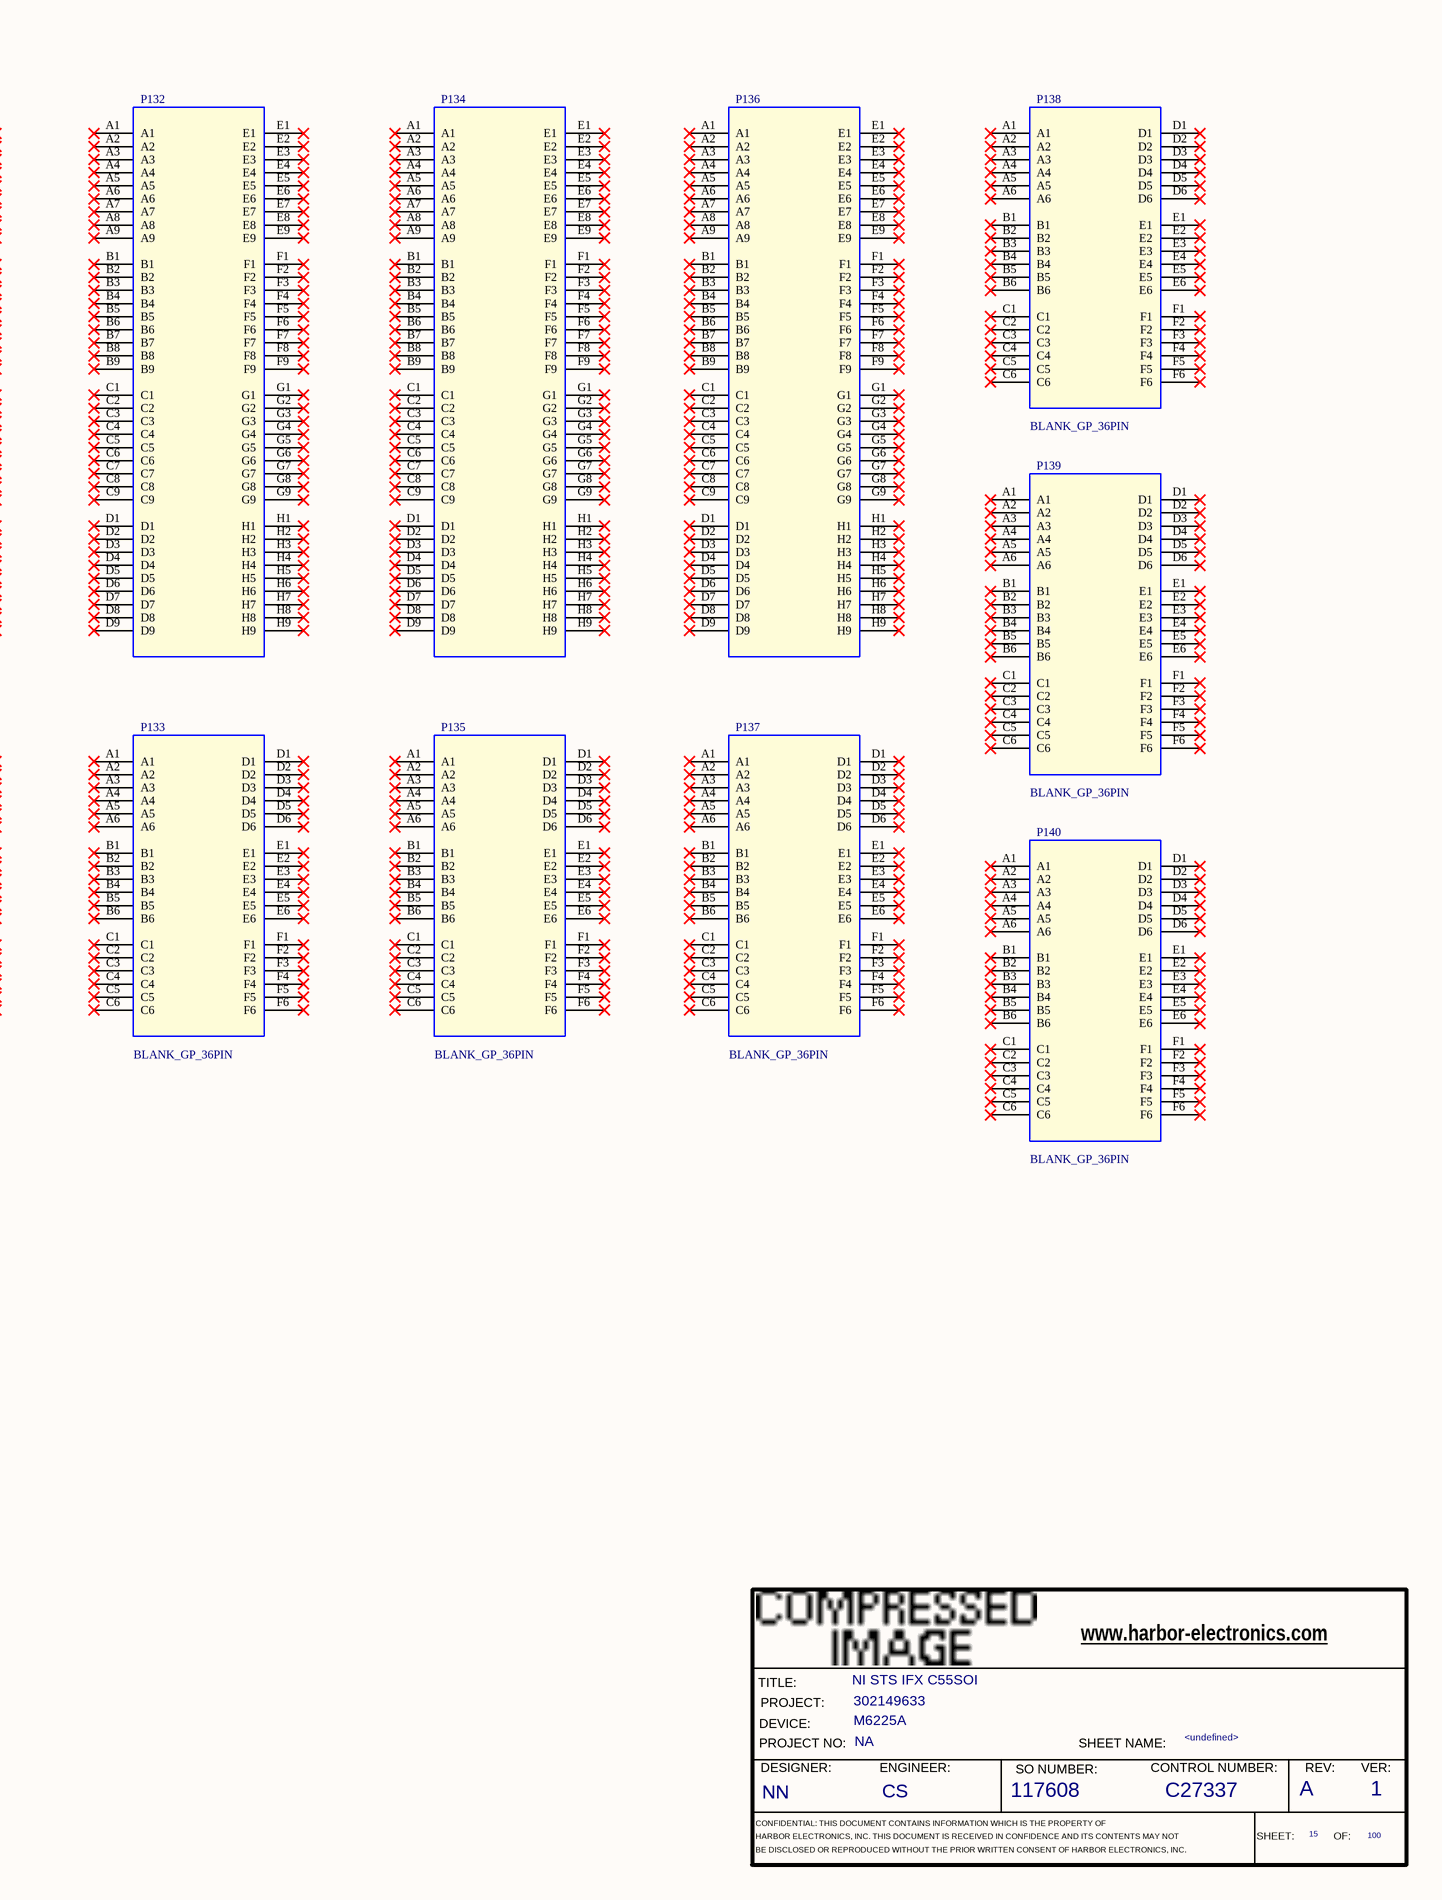
[diagram p32: 51-BLANK 121-140.SchDoc, right]

### Parts
(Parts that share a designator on the sheet are numbered #1, #2 ... from top to bottom, then left to right.)
*#13  RevCode: A  Title: NI STS IFX C55SOI  Page Number: 15  Page Count: 100  Engineer: CS  Designer: NN  SO Number: 117608  Control Number: C27337  Version: 1  Page Name: <undefined>  PROJECT: 302149633  DEVICE: M6225A  PROJECT NO.: NA  (hidden comment: HE_DEFAULT)  (graphical)
P121  BLANK_GP_36PIN  [285092A-08_36PIN_NOVIA]
P122  BLANK_GP_36PIN  [285092A-08_36PIN_NOVIA]
P123  BLANK_GP_36PIN  [285092A-08_36PIN_NOVIA]
P124  (no value)  [285092A-08_72PIN_NOVIA]
P125  BLANK_GP_36PIN  [285092A-08_36PIN_NOVIA]
P126  (no value)  [285092A-08_72PIN_NOVIA]
P127  BLANK_GP_36PIN  [285092A-08_36PIN_NOVIA]
P128  (no value)  [285092A-08_72PIN_NOVIA]
P129  BLANK_GP_36PIN  [285092A-08_36PIN_NOVIA]
P130  (no value)  [285092A-08_72PIN_NOVIA]
P131  BLANK_GP_36PIN  [285092A-08_36PIN_NOVIA]
P132  (no value)  [285092A-08_72PIN_NOVIA]
P133  BLANK_GP_36PIN  [285092A-08_36PIN_NOVIA]
P134  (no value)  [285092A-08_72PIN_NOVIA]
P135  BLANK_GP_36PIN  [285092A-08_36PIN_NOVIA]
P136  (no value)  [285092A-08_72PIN_NOVIA]
P137  BLANK_GP_36PIN  [285092A-08_36PIN_NOVIA]
P138  BLANK_GP_36PIN  [285092A-08_36PIN_NOVIA]
P139  BLANK_GP_36PIN  [285092A-08_36PIN_NOVIA]
P140  BLANK_GP_36PIN  [285092A-08_36PIN_NOVIA]

### Nets

Not connected (* = marked no-connect by the designer): P121 A1* A2* A3* A4* A5* A6* B1* B2* B3* B4* B5* B6* C1* C2* C3* C4* C5* C6* D1* D2* D3* D4* D5* D6* E1* E2* E3* E4* E5* E6* F1* F2* F3* F4* F5* F6*; P122 A1* A2* A3* A4* A5* A6* B1* B2* B3* B4* B5* B6* C1* C2* C3* C4* C5* C6* D1* D2* D3* D4* D5* D6* E1* E2* E3* E4* E5* E6* F1* F2* F3* F4* F5* F6*; P123 A1* A2* A3* A4* A5* A6* B1* B2* B3* B4* B5* B6* C1* C2* C3* C4* C5* C6* D1* D2* D3* D4* D5* D6* E1* E2* E3* E4* E5* E6* F1* F2* F3* F4* F5* F6*; P124 A1* A2* A3* A4* A5* A6* A7* A8* A9* B1* B2* B3* B4* B5* B6* B7* B8* B9* C1* C2* C3* C4* C5* C6* C7* C8* C9* D1* D2* D3* D4* D5* D6* D7* D8* D9* E1* E2* E3* E4* E5* E6* E7* E8* E9* F1* F2* F3* F4* F5* F6* F7* F8* F9* G1* G2* G3* G4* G5* G6* G7* G8* G9* H1* H2* H3* H4* H5* H6* H7* H8* H9*; P125 A1* A2* A3* A4* A5* A6* B1* B2* B3* B4* B5* B6* C1* C2* C3* C4* C5* C6* D1* D2* D3* D4* D5* D6* E1* E2* E3* E4* E5* E6* F1* F2* F3* F4* F5* F6*; P126 A1* A2* A3* A4* A5* A6* A7* A8* A9* B1* B2* B3* B4* B5* B6* B7* B8* B9* C1* C2* C3* C4* C5* C6* C7* C8* C9* D1* D2* D3* D4* D5* D6* D7* D8* D9* E1* E2* E3* E4* E5* E6* E7* E8* E9* F1* F2* F3* F4* F5* F6* F7* F8* F9* G1* G2* G3* G4* G5* G6* G7* G8* G9* H1* H2* H3* H4* H5* H6* H7* H8* H9*; P127 A1* A2* A3* A4* A5* A6* B1* B2* B3* B4* B5* B6* C1* C2* C3* C4* C5* C6* D1* D2* D3* D4* D5* D6* E1* E2* E3* E4* E5* E6* F1* F2* F3* F4* F5* F6*; P128 A1* A2* A3* A4* A5* A6* A7* A8* A9* B1* B2* B3* B4* B5* B6* B7* B8* B9* C1* C2* C3* C4* C5* C6* C7* C8* C9* D1* D2* D3* D4* D5* D6* D7* D8* D9* E1* E2* E3* E4* E5* E6* E7* E8* E9* F1* F2* F3* F4* F5* F6* F7* F8* F9* G1* G2* G3* G4* G5* G6* G7* G8* G9* H1* H2* H3* H4* H5* H6* H7* H8* H9*; P129 A1* A2* A3* A4* A5* A6* B1* B2* B3* B4* B5* B6* C1* C2* C3* C4* C5* C6* D1* D2* D3* D4* D5* D6* E1* E2* E3* E4* E5* E6* F1* F2* F3* F4* F5* F6*; P130 A1* A2* A3* A4* A5* A6* A7* A8* A9* B1* B2* B3* B4* B5* B6* B7* B8* B9* C1* C2* C3* C4* C5* C6* C7* C8* C9* D1* D2* D3* D4* D5* D6* D7* D8* D9* E1* E2* E3* E4* E5* E6* E7* E8* E9* F1* F2* F3* F4* F5* F6* F7* F8* F9* G1* G2* G3* G4* G5* G6* G7* G8* G9* H1* H2* H3* H4* H5* H6* H7* H8* H9*; P131 A1* A2* A3* A4* A5* A6* B1* B2* B3* B4* B5* B6* C1* C2* C3* C4* C5* C6* D1* D2* D3* D4* D5* D6* E1* E2* E3* E4* E5* E6* F1* F2* F3* F4* F5* F6*; P132 A1* A2* A3* A4* A5* A6* A7* A8* A9* B1* B2* B3* B4* B5* B6* B7* B8* B9* C1* C2* C3* C4* C5* C6* C7* C8* C9* D1* D2* D3* D4* D5* D6* D7* D8* D9* E1* E2* E3* E4* E5* E6* E7* E8* E9* F1* F2* F3* F4* F5* F6* F7* F8* F9* G1* G2* G3* G4* G5* G6* G7* G8* G9* H1* H2* H3* H4* H5* H6* H7* H8* H9*; P133 A1* A2* A3* A4* A5* A6* B1* B2* B3* B4* B5* B6* C1* C2* C3* C4* C5* C6* D1* D2* D3* D4* D5* D6* E1* E2* E3* E4* E5* E6* F1* F2* F3* F4* F5* F6*; P134 A1* A2* A3* A4* A5* A6* A7* A8* A9* B1* B2* B3* B4* B5* B6* B7* B8* B9* C1* C2* C3* C4* C5* C6* C7* C8* C9* D1* D2* D3* D4* D5* D6* D7* D8* D9* E1* E2* E3* E4* E5* E6* E7* E8* E9* F1* F2* F3* F4* F5* F6* F7* F8* F9* G1* G2* G3* G4* G5* G6* G7* G8* G9* H1* H2* H3* H4* H5* H6* H7* H8* H9*; P135 A1* A2* A3* A4* A5* A6* B1* B2* B3* B4* B5* B6* C1* C2* C3* C4* C5* C6* D1* D2* D3* D4* D5* D6* E1* E2* E3* E4* E5* E6* F1* F2* F3* F4* F5* F6*; P136 A1* A2* A3* A4* A5* A6* A7* A8* A9* B1* B2* B3* B4* B5* B6* B7* B8* B9* C1* C2* C3* C4* C5* C6* C7* C8* C9* D1* D2* D3* D4* D5* D6* D7* D8* D9* E1* E2* E3* E4* E5* E6* E7* E8* E9* F1* F2* F3* F4* F5* F6* F7* F8* F9* G1* G2* G3* G4* G5* G6* G7* G8* G9* H1* H2* H3* H4* H5* H6* H7* H8* H9*; P137 A1* A2* A3* A4* A5* A6* B1* B2* B3* B4* B5* B6* C1* C2* C3* C4* C5* C6* D1* D2* D3* D4* D5* D6* E1* E2* E3* E4* E5* E6* F1* F2* F3* F4* F5* F6*; P138 A1* A2* A3* A4* A5* A6* B1* B2* B3* B4* B5* B6* C1* C2* C3* C4* C5* C6* D1* D2* D3* D4* D5* D6* E1* E2* E3* E4* E5* E6* F1* F2* F3* F4* F5* F6*; P139 A1* A2* A3* A4* A5* A6* B1* B2* B3* B4* B5* B6* C1* C2* C3* C4* C5* C6* D1* D2* D3* D4* D5* D6* E1* E2* E3* E4* E5* E6* F1* F2* F3* F4* F5* F6*; P140 A1* A2* A3* A4* A5* A6* B1* B2* B3* B4* B5* B6* C1* C2* C3* C4* C5* C6* D1* D2* D3* D4* D5* D6* E1* E2* E3* E4* E5* E6* F1* F2* F3* F4* F5* F6*

### Notes on the sheet
- TESTER PAGES
- (in symbol HE_DEFAULT) www.harbor-electronics.com; TITLE:; PROJECT:; DEVICE:; PROJECT NO:; SHEET NAME:; DESIGNER:; ENGINEER:; SO NUMBER:; CONTROL NUMBER:; REV:; VER:; CONFIDENTIAL: THIS DOCUMENT CONTAINS INFORMATION WHICH IS THE PROPERTY OF; HARBOR ELECTRONICS, INC. THIS DOCUMENT IS RECEIVED IN CONFIDENCE AND ITS CONTENTS MAY NOT; SHEET:; OF:; BE DISCLOSED OR REPRODUCED WITHOUT THE PRIOR WRITTEN CONSENT OF HARBOR ELECTRONICS, INC.

### Library data of the parts
*#13 = HE_DEFAULT: as *#9 on sheet 43-PSU_SMU_HP
P121-P123 P125 P127 P129 P131 P133 P135 P137-P140 = BLANK_GP_36PIN: ALT_SYMBOLS: 285092A-08_36PIN; PCB Footprint: 285092A-08_36PIN_NOVIA
P124 P126 P128 P130 P132 P134 P136 = BLANK_COAX_72PIN: ALT_SYMBOLS: 285092A-08_72PIN; PCB Footprint: 285092A-08_72PIN_NOVIA

## Sheet 53-BLANK 161-180.SchDoc
size 594 x 420 mm
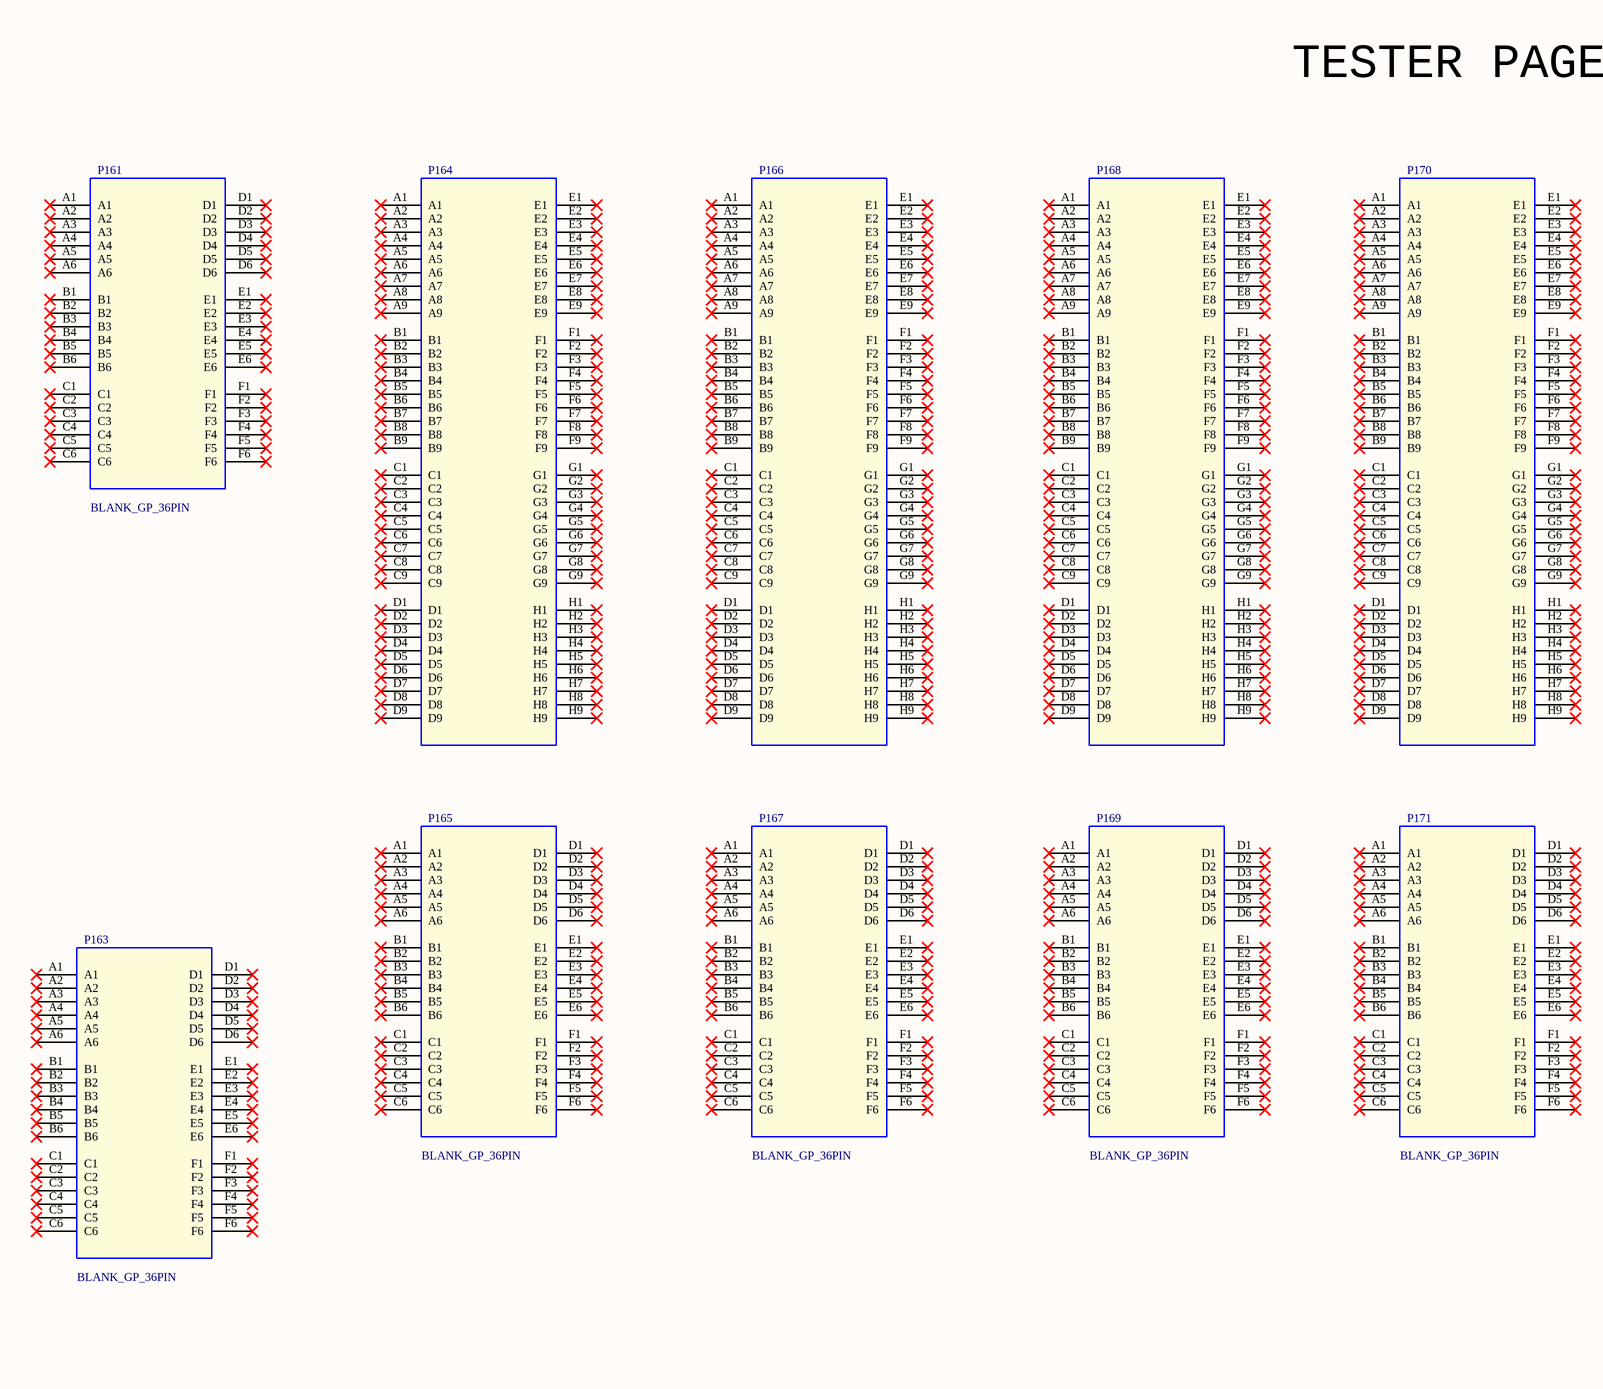
[diagram p33: 53-BLANK 161-180.SchDoc, left]
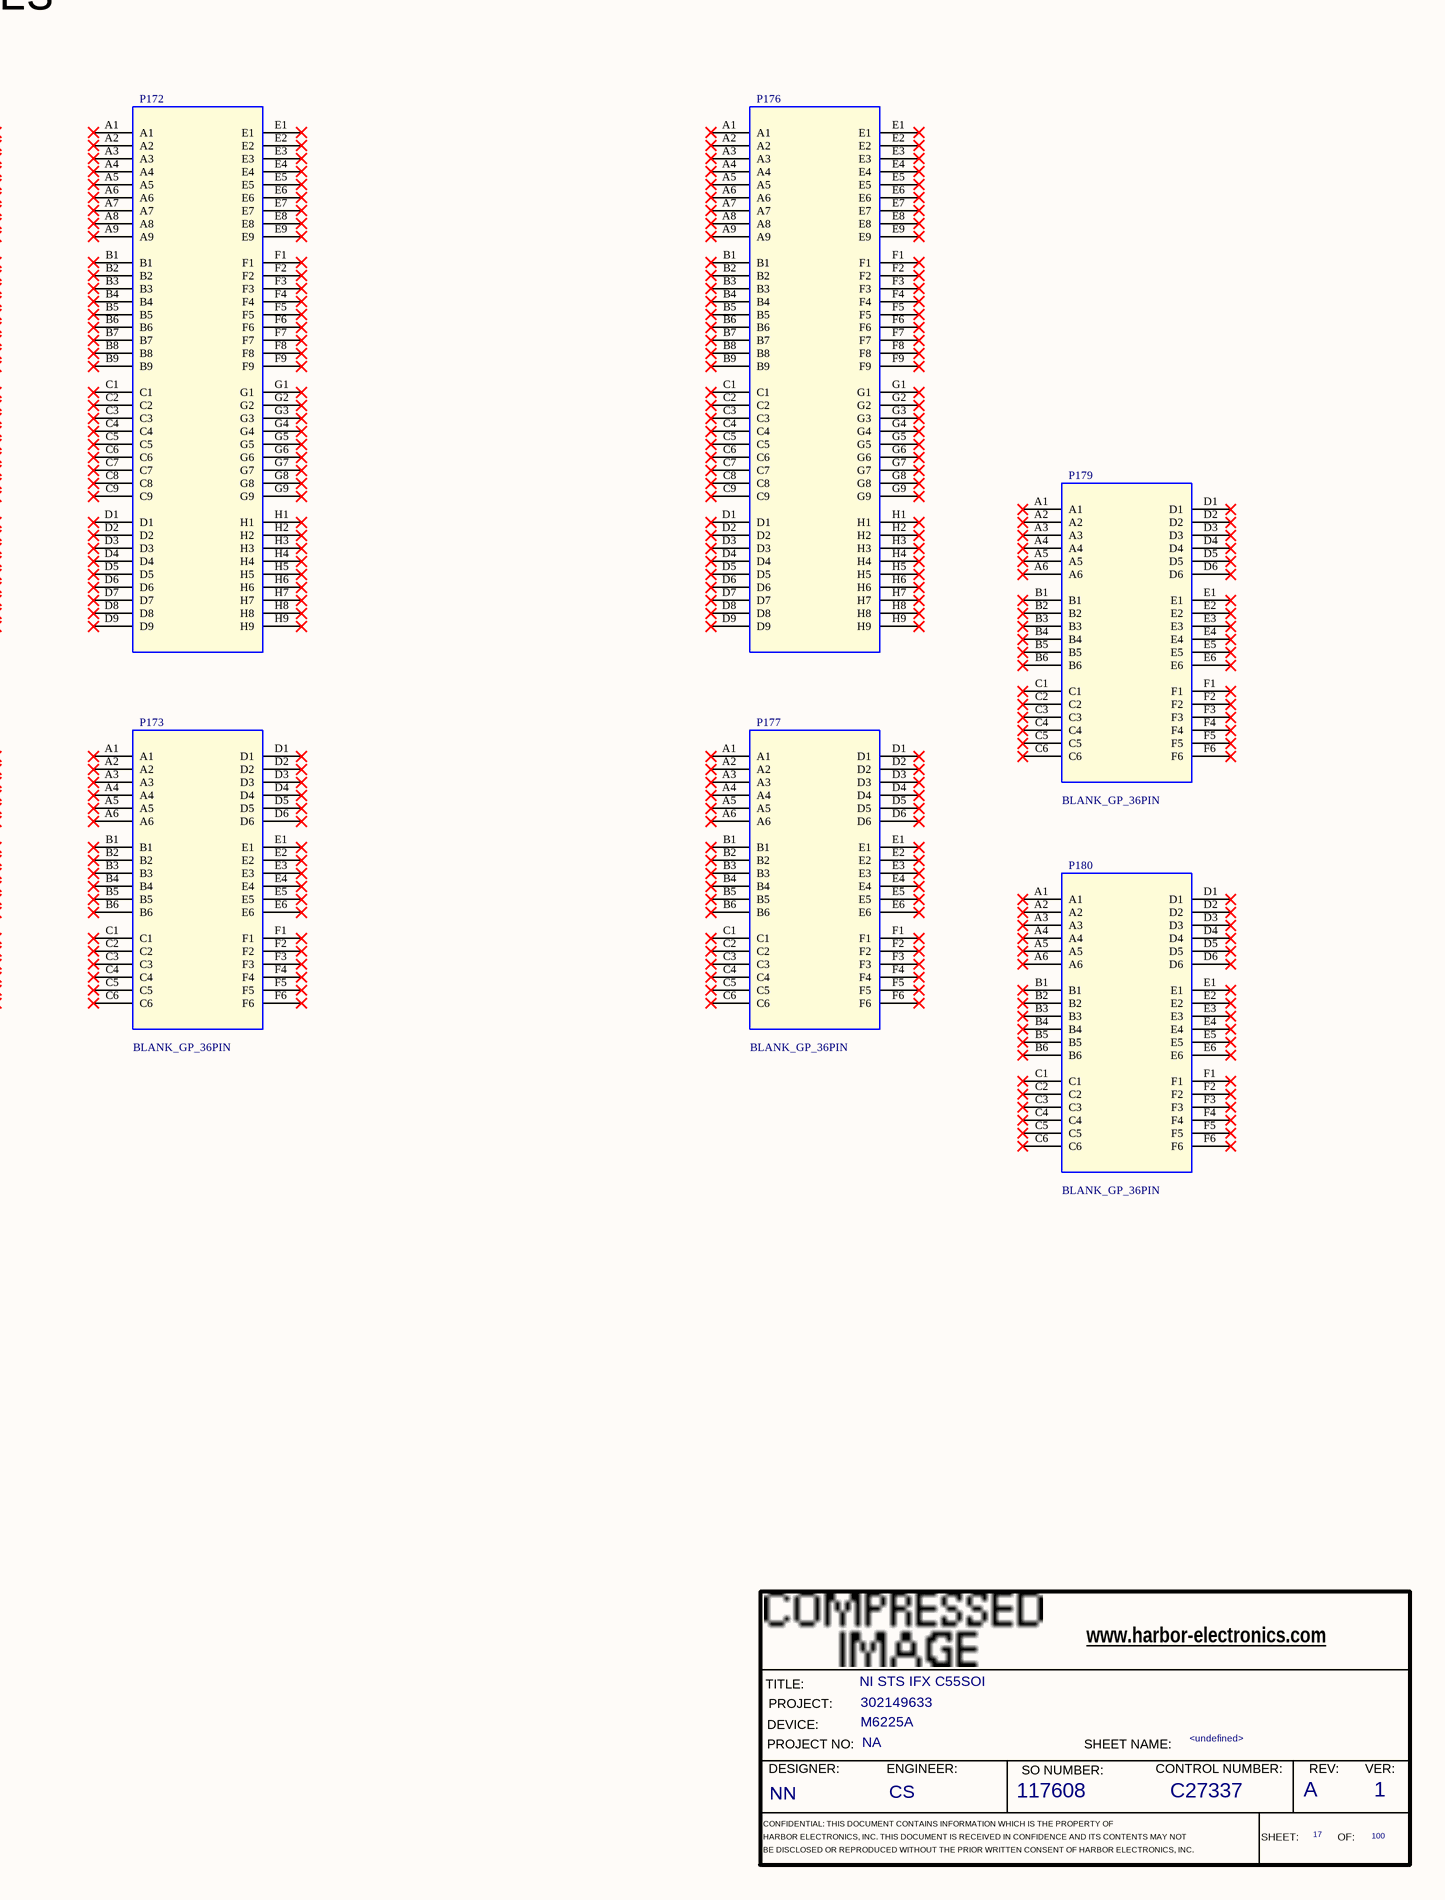
[diagram p34: 53-BLANK 161-180.SchDoc, right]

### Parts
(Parts that share a designator on the sheet are numbered #1, #2 ... from top to bottom, then left to right.)
*#14  RevCode: A  Title: NI STS IFX C55SOI  Page Number: 17  Page Count: 100  Engineer: CS  Designer: NN  SO Number: 117608  Control Number: C27337  Version: 1  Page Name: <undefined>  PROJECT: 302149633  DEVICE: M6225A  PROJECT NO.: NA  (hidden comment: HE_DEFAULT)  (graphical)
P161  BLANK_GP_36PIN  [285092A-08_36PIN_NOVIA]
P163  BLANK_GP_36PIN  [285092A-08_36PIN_NOVIA]
P164  (no value)  [285092A-08_72PIN_NOVIA]
P165  BLANK_GP_36PIN  [285092A-08_36PIN_NOVIA]
P166  (no value)  [285092A-08_72PIN_NOVIA]
P167  BLANK_GP_36PIN  [285092A-08_36PIN_NOVIA]
P168  (no value)  [285092A-08_72PIN_NOVIA]
P169  BLANK_GP_36PIN  [285092A-08_36PIN_NOVIA]
P170  (no value)  [285092A-08_72PIN_NOVIA]
P171  BLANK_GP_36PIN  [285092A-08_36PIN_NOVIA]
P172  (no value)  [285092A-08_72PIN_NOVIA]
P173  BLANK_GP_36PIN  [285092A-08_36PIN_NOVIA]
P176  (no value)  [285092A-08_72PIN_NOVIA]
P177  BLANK_GP_36PIN  [285092A-08_36PIN_NOVIA]
P179  BLANK_GP_36PIN  [285092A-08_36PIN_NOVIA]
P180  BLANK_GP_36PIN  [285092A-08_36PIN_NOVIA]

### Nets

Not connected (* = marked no-connect by the designer): P161 A1* A2* A3* A4* A5* A6* B1* B2* B3* B4* B5* B6* C1* C2* C3* C4* C5* C6* D1* D2* D3* D4* D5* D6* E1* E2* E3* E4* E5* E6* F1* F2* F3* F4* F5* F6*; P163 A1* A2* A3* A4* A5* A6* B1* B2* B3* B4* B5* B6* C1* C2* C3* C4* C5* C6* D1* D2* D3* D4* D5* D6* E1* E2* E3* E4* E5* E6* F1* F2* F3* F4* F5* F6*; P164 A1* A2* A3* A4* A5* A6* A7* A8* A9* B1* B2* B3* B4* B5* B6* B7* B8* B9* C1* C2* C3* C4* C5* C6* C7* C8* C9* D1* D2* D3* D4* D5* D6* D7* D8* D9* E1* E2* E3* E4* E5* E6* E7* E8* E9* F1* F2* F3* F4* F5* F6* F7* F8* F9* G1* G2* G3* G4* G5* G6* G7* G8* G9* H1* H2* H3* H4* H5* H6* H7* H8* H9*; P165 A1* A2* A3* A4* A5* A6* B1* B2* B3* B4* B5* B6* C1* C2* C3* C4* C5* C6* D1* D2* D3* D4* D5* D6* E1* E2* E3* E4* E5* E6* F1* F2* F3* F4* F5* F6*; P166 A1* A2* A3* A4* A5* A6* A7* A8* A9* B1* B2* B3* B4* B5* B6* B7* B8* B9* C1* C2* C3* C4* C5* C6* C7* C8* C9* D1* D2* D3* D4* D5* D6* D7* D8* D9* E1* E2* E3* E4* E5* E6* E7* E8* E9* F1* F2* F3* F4* F5* F6* F7* F8* F9* G1* G2* G3* G4* G5* G6* G7* G8* G9* H1* H2* H3* H4* H5* H6* H7* H8* H9*; P167 A1* A2* A3* A4* A5* A6* B1* B2* B3* B4* B5* B6* C1* C2* C3* C4* C5* C6* D1* D2* D3* D4* D5* D6* E1* E2* E3* E4* E5* E6* F1* F2* F3* F4* F5* F6*; P168 A1* A2* A3* A4* A5* A6* A7* A8* A9* B1* B2* B3* B4* B5* B6* B7* B8* B9* C1* C2* C3* C4* C5* C6* C7* C8* C9* D1* D2* D3* D4* D5* D6* D7* D8* D9* E1* E2* E3* E4* E5* E6* E7* E8* E9* F1* F2* F3* F4* F5* F6* F7* F8* F9* G1* G2* G3* G4* G5* G6* G7* G8* G9* H1* H2* H3* H4* H5* H6* H7* H8* H9*; P169 A1* A2* A3* A4* A5* A6* B1* B2* B3* B4* B5* B6* C1* C2* C3* C4* C5* C6* D1* D2* D3* D4* D5* D6* E1* E2* E3* E4* E5* E6* F1* F2* F3* F4* F5* F6*; P170 A1* A2* A3* A4* A5* A6* A7* A8* A9* B1* B2* B3* B4* B5* B6* B7* B8* B9* C1* C2* C3* C4* C5* C6* C7* C8* C9* D1* D2* D3* D4* D5* D6* D7* D8* D9* E1* E2* E3* E4* E5* E6* E7* E8* E9* F1* F2* F3* F4* F5* F6* F7* F8* F9* G1* G2* G3* G4* G5* G6* G7* G8* G9* H1* H2* H3* H4* H5* H6* H7* H8* H9*; P171 A1* A2* A3* A4* A5* A6* B1* B2* B3* B4* B5* B6* C1* C2* C3* C4* C5* C6* D1* D2* D3* D4* D5* D6* E1* E2* E3* E4* E5* E6* F1* F2* F3* F4* F5* F6*; P172 A1* A2* A3* A4* A5* A6* A7* A8* A9* B1* B2* B3* B4* B5* B6* B7* B8* B9* C1* C2* C3* C4* C5* C6* C7* C8* C9* D1* D2* D3* D4* D5* D6* D7* D8* D9* E1* E2* E3* E4* E5* E6* E7* E8* E9* F1* F2* F3* F4* F5* F6* F7* F8* F9* G1* G2* G3* G4* G5* G6* G7* G8* G9* H1* H2* H3* H4* H5* H6* H7* H8* H9*; P173 A1* A2* A3* A4* A5* A6* B1* B2* B3* B4* B5* B6* C1* C2* C3* C4* C5* C6* D1* D2* D3* D4* D5* D6* E1* E2* E3* E4* E5* E6* F1* F2* F3* F4* F5* F6*; P176 A1* A2* A3* A4* A5* A6* A7* A8* A9* B1* B2* B3* B4* B5* B6* B7* B8* B9* C1* C2* C3* C4* C5* C6* C7* C8* C9* D1* D2* D3* D4* D5* D6* D7* D8* D9* E1* E2* E3* E4* E5* E6* E7* E8* E9* F1* F2* F3* F4* F5* F6* F7* F8* F9* G1* G2* G3* G4* G5* G6* G7* G8* G9* H1* H2* H3* H4* H5* H6* H7* H8* H9*; P177 A1* A2* A3* A4* A5* A6* B1* B2* B3* B4* B5* B6* C1* C2* C3* C4* C5* C6* D1* D2* D3* D4* D5* D6* E1* E2* E3* E4* E5* E6* F1* F2* F3* F4* F5* F6*; P179 A1* A2* A3* A4* A5* A6* B1* B2* B3* B4* B5* B6* C1* C2* C3* C4* C5* C6* D1* D2* D3* D4* D5* D6* E1* E2* E3* E4* E5* E6* F1* F2* F3* F4* F5* F6*; P180 A1* A2* A3* A4* A5* A6* B1* B2* B3* B4* B5* B6* C1* C2* C3* C4* C5* C6* D1* D2* D3* D4* D5* D6* E1* E2* E3* E4* E5* E6* F1* F2* F3* F4* F5* F6*

### Notes on the sheet
- TESTER PAGES
- (in symbol HE_DEFAULT) www.harbor-electronics.com; TITLE:; PROJECT:; DEVICE:; PROJECT NO:; SHEET NAME:; DESIGNER:; ENGINEER:; SO NUMBER:; CONTROL NUMBER:; REV:; VER:; CONFIDENTIAL: THIS DOCUMENT CONTAINS INFORMATION WHICH IS THE PROPERTY OF; HARBOR ELECTRONICS, INC. THIS DOCUMENT IS RECEIVED IN CONFIDENCE AND ITS CONTENTS MAY NOT; SHEET:; OF:; BE DISCLOSED OR REPRODUCED WITHOUT THE PRIOR WRITTEN CONSENT OF HARBOR ELECTRONICS, INC.

### Library data of the parts
*#14 = HE_DEFAULT: as *#9 on sheet 43-PSU_SMU_HP
P161 P163 P165 P167 P169 P171 P173 P177 P179 P180 = BLANK_GP_36PIN: ALT_SYMBOLS: 285092A-08_36PIN; PCB Footprint: 285092A-08_36PIN_NOVIA
P164 P166 P168 P170 P172 P176 = BLANK_COAX_72PIN: ALT_SYMBOLS: 285092A-08_72PIN; PCB Footprint: 285092A-08_72PIN_NOVIA

## Nets that join several sheets
GND: 04-DUT0-1 (50 pins), 05-DUT2-3 (138 pins), 40-DIGITAL (74 pins), 43-PSU_SMU_HP (8 pins)
NetC1_0_1: 04-DUT0-1 (C1_0.1 DUT_0.4 R2_0.1), 40-DIGITAL (P174.A9)
NetC1_1_1: 04-DUT0-1 (C1_1.1 DUT_1.4 R2_1.1), 40-DIGITAL (P174.E9)
NetC1_2_1: 05-DUT2-3 (C1_2.1 DUT_2.4 R2_2.1), 40-DIGITAL (P154.A9)
NetC1_3_1: 05-DUT2-3 (C1_3.1 DUT_3.4 R2_3.1), 40-DIGITAL (P154.E9)
NetC5_0_1: 04-DUT0-1 (C5_0.1 DUT_0.2 R4_0.1), 40-DIGITAL (P174.B8)
NetC5_1_1: 04-DUT0-1 (C5_1.1 DUT_1.2 R4_1.1), 40-DIGITAL (P174.F8)
NetC5_2_1: 05-DUT2-3 (C5_2.1 DUT_2.2 R4_2.1), 40-DIGITAL (P154.B8)
NetC5_3_1: 05-DUT2-3 (C5_3.1 DUT_3.2 R4_3.1), 40-DIGITAL (P154.F8)
NetMOS1_1_1: 04-DUT0-1 (MOS1_1.1 R5_1.1), 40-DIGITAL (P174.G9)
NetMOS1_2_1: 05-DUT2-3 (MOS1_2.1 R5_2.1), 40-DIGITAL (P154.C9)
NetMOS1_3_1: 05-DUT2-3 (MOS1_3.1 R5_3.1), 40-DIGITAL (P154.G9)
NetMOS2_0_1: 04-DUT0-1 (MOS2_0.1 R6_0.1), 40-DIGITAL (P174.D8)
NetMOS2_1_1: 04-DUT0-1 (MOS2_1.1 R6_1.1), 40-DIGITAL (P174.H8)
NetMOS2_2_1: 05-DUT2-3 (MOS2_2.1 R6_2.1), 40-DIGITAL (P154.D8)
NetMOS2_3_1: 05-DUT2-3 (MOS2_3.1 R6_3.1), 40-DIGITAL (P154.H8)
NetMOS5_0_1: 04-DUT0-1 (MOS5_0.1 R9_0.1), 40-DIGITAL (P174.C5)
NetMOS5_1_1: 04-DUT0-1 (MOS5_1.1 R9_1.1), 40-DIGITAL (P174.A1)
NetP154_A1: 05-DUT2-3 (R9_3.1), 40-DIGITAL (P154.A1)
NetP154_C1: 05-DUT2-3 (R10_3.1), 40-DIGITAL (P154.C1)
NetP154_C3: 05-DUT2-3 (R11_2.1), 40-DIGITAL (P154.C3)
NetP154_C5: 05-DUT2-3 (R9_2.1), 40-DIGITAL (P154.C5)
NetP154_C7: 05-DUT2-3 (R7_2.1), 40-DIGITAL (P154.C7)
NetP154_D2: 05-DUT2-3 (R12_2.1), 40-DIGITAL (P154.D2)
NetP154_D4: 05-DUT2-3 (R10_2.1), 40-DIGITAL (P154.D4)
NetP154_D6: 05-DUT2-3 (R8_2.1), 40-DIGITAL (P154.D6)
NetP154_G3: 05-DUT2-3 (R7_3.1), 40-DIGITAL (P154.G3)
NetP154_G5: 05-DUT2-3 (R11_3.1), 40-DIGITAL (P154.G5)
NetP154_H2: 05-DUT2-3 (R8_3.1), 40-DIGITAL (P154.H2)
NetP154_H4: 05-DUT2-3 (R12_3.1), 40-DIGITAL (P154.H4)
NetP174_C1: 04-DUT0-1 (R10_1.1), 40-DIGITAL (P174.C1)
NetP174_C3: 04-DUT0-1 (R11_0.1), 40-DIGITAL (P174.C3)
NetP174_C7: 04-DUT0-1 (R7_0.1), 40-DIGITAL (P174.C7)
NetP174_C9: 04-DUT0-1 (R5_0.1), 40-DIGITAL (P174.C9)
NetP174_D2: 04-DUT0-1 (R12_0.1), 40-DIGITAL (P174.D2)
NetP174_D4: 04-DUT0-1 (R10_0.1), 40-DIGITAL (P174.D4)
NetP174_D6: 04-DUT0-1 (R8_0.1), 40-DIGITAL (P174.D6)
NetP174_G3: 04-DUT0-1 (R7_1.1), 40-DIGITAL (P174.G3)
NetP174_G5: 04-DUT0-1 (R11_1.1), 40-DIGITAL (P174.G5)
NetP174_H2: 04-DUT0-1 (R8_1.1), 40-DIGITAL (P174.H2)
NetP174_H4: 04-DUT0-1 (R12_1.1), 40-DIGITAL (P174.H4)